# EasyEDA Pro project VGA_VCA821放大器.eprj

# Schematic Schematic2

## Sheets
1 P1: Board Name: Board1; Create Date: 2025-02-21; Page Name: P1; Project Name: VGA_VCA821放大器; Schematic Name: Schematic2; Update Date: 2025-05-27; Company: 嘉立创EDA; Page Size: A4; Version: V1.0
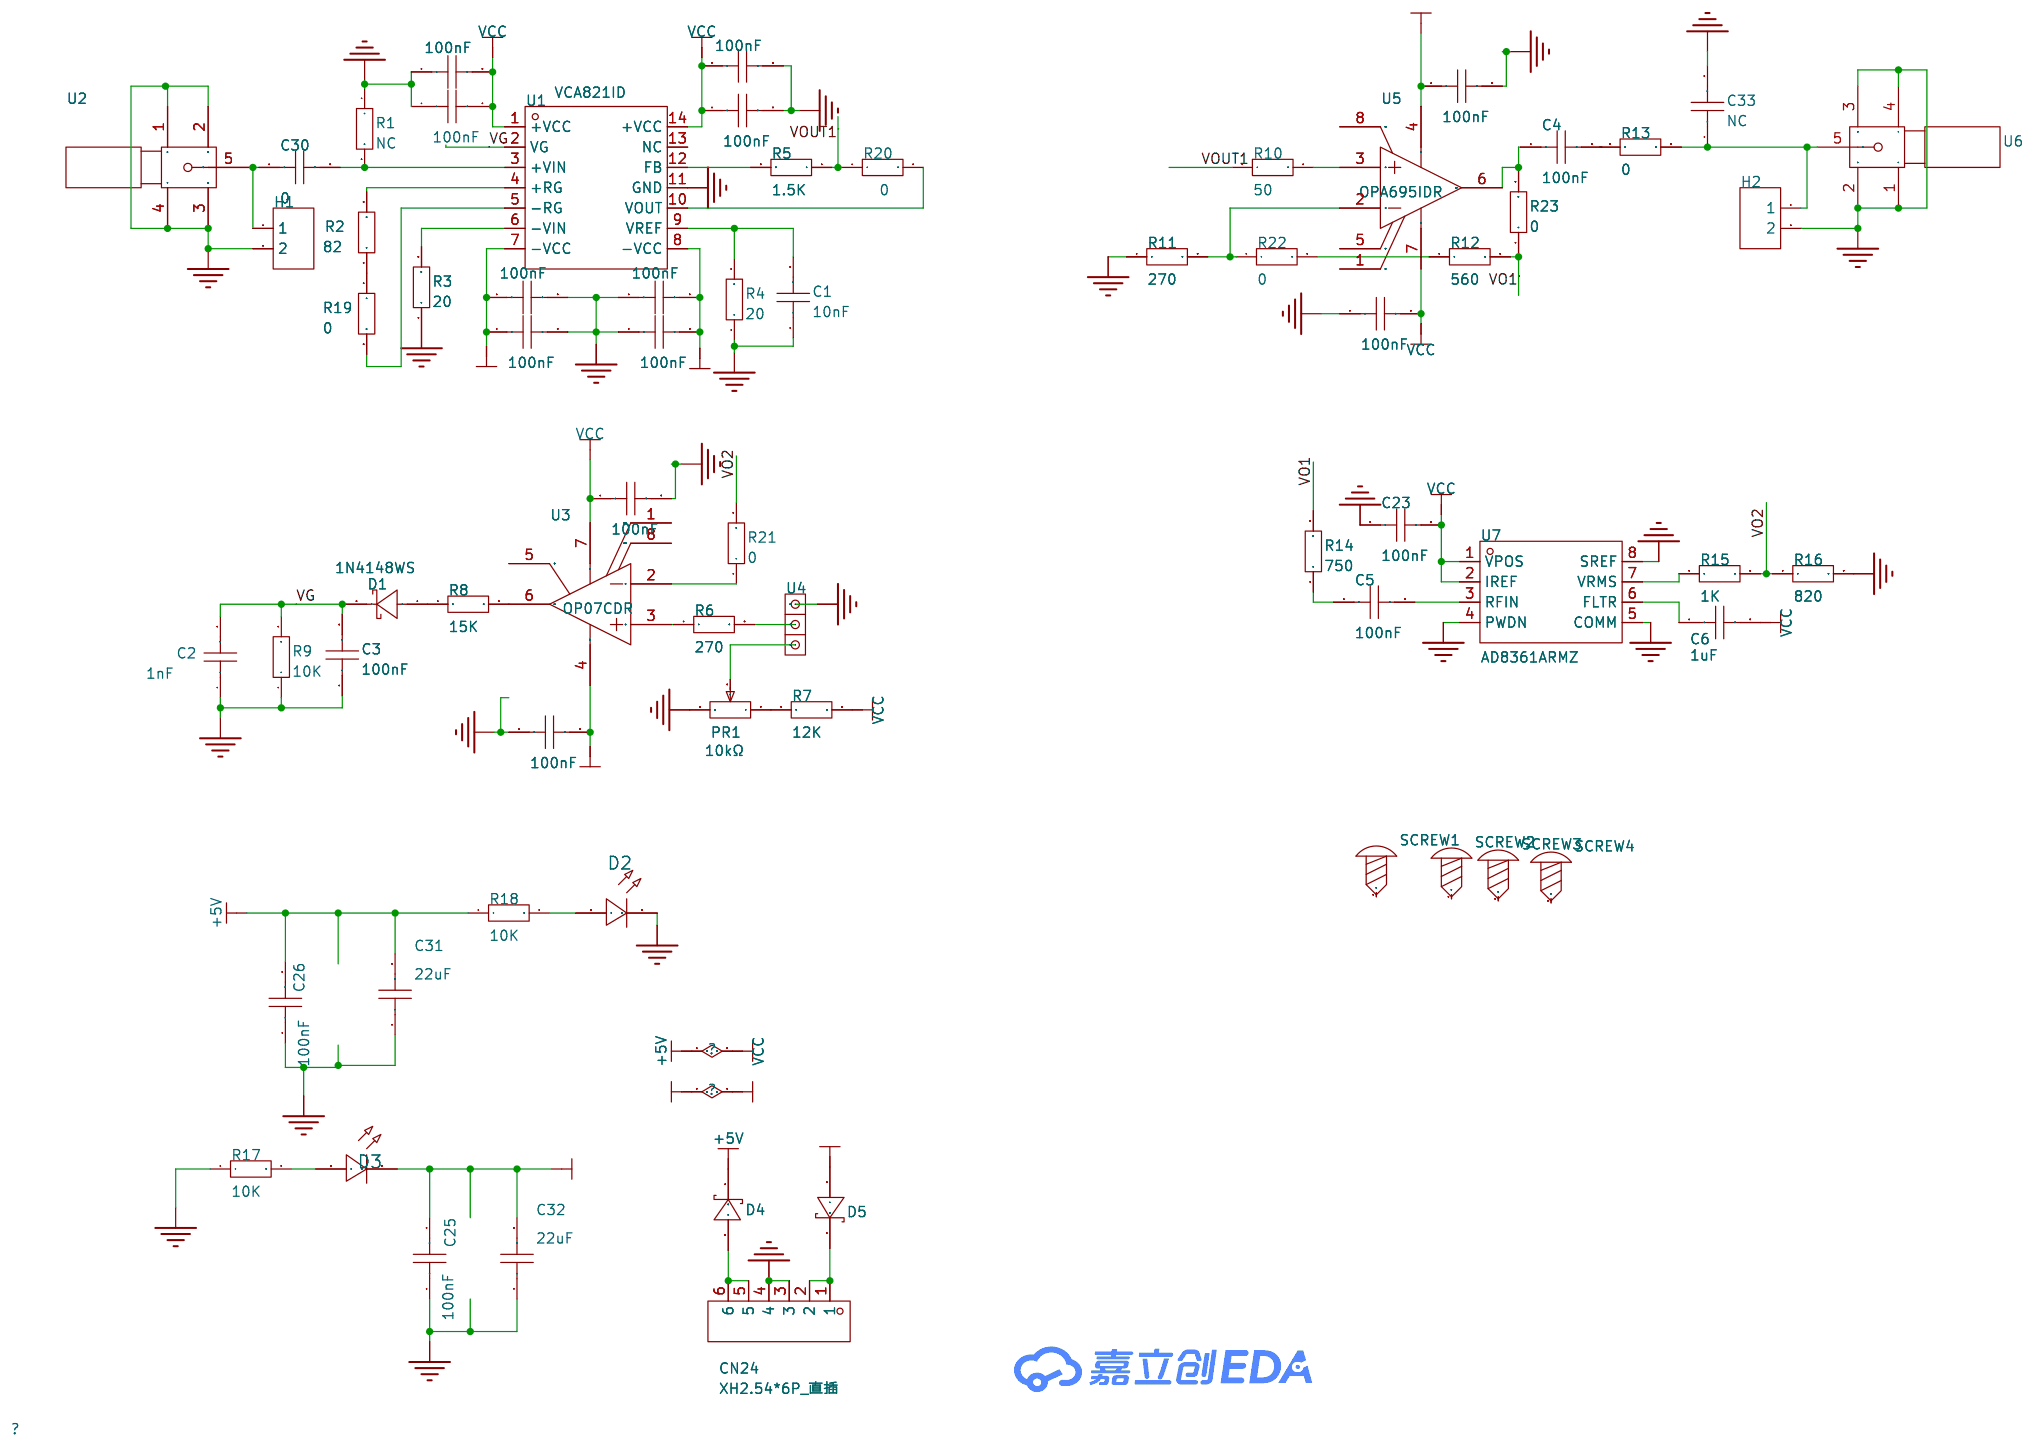
[diagram p0: P1]
2 P2: Create Date: 2025-05-26; Page Name: P2; Update Date: 2025-07-02
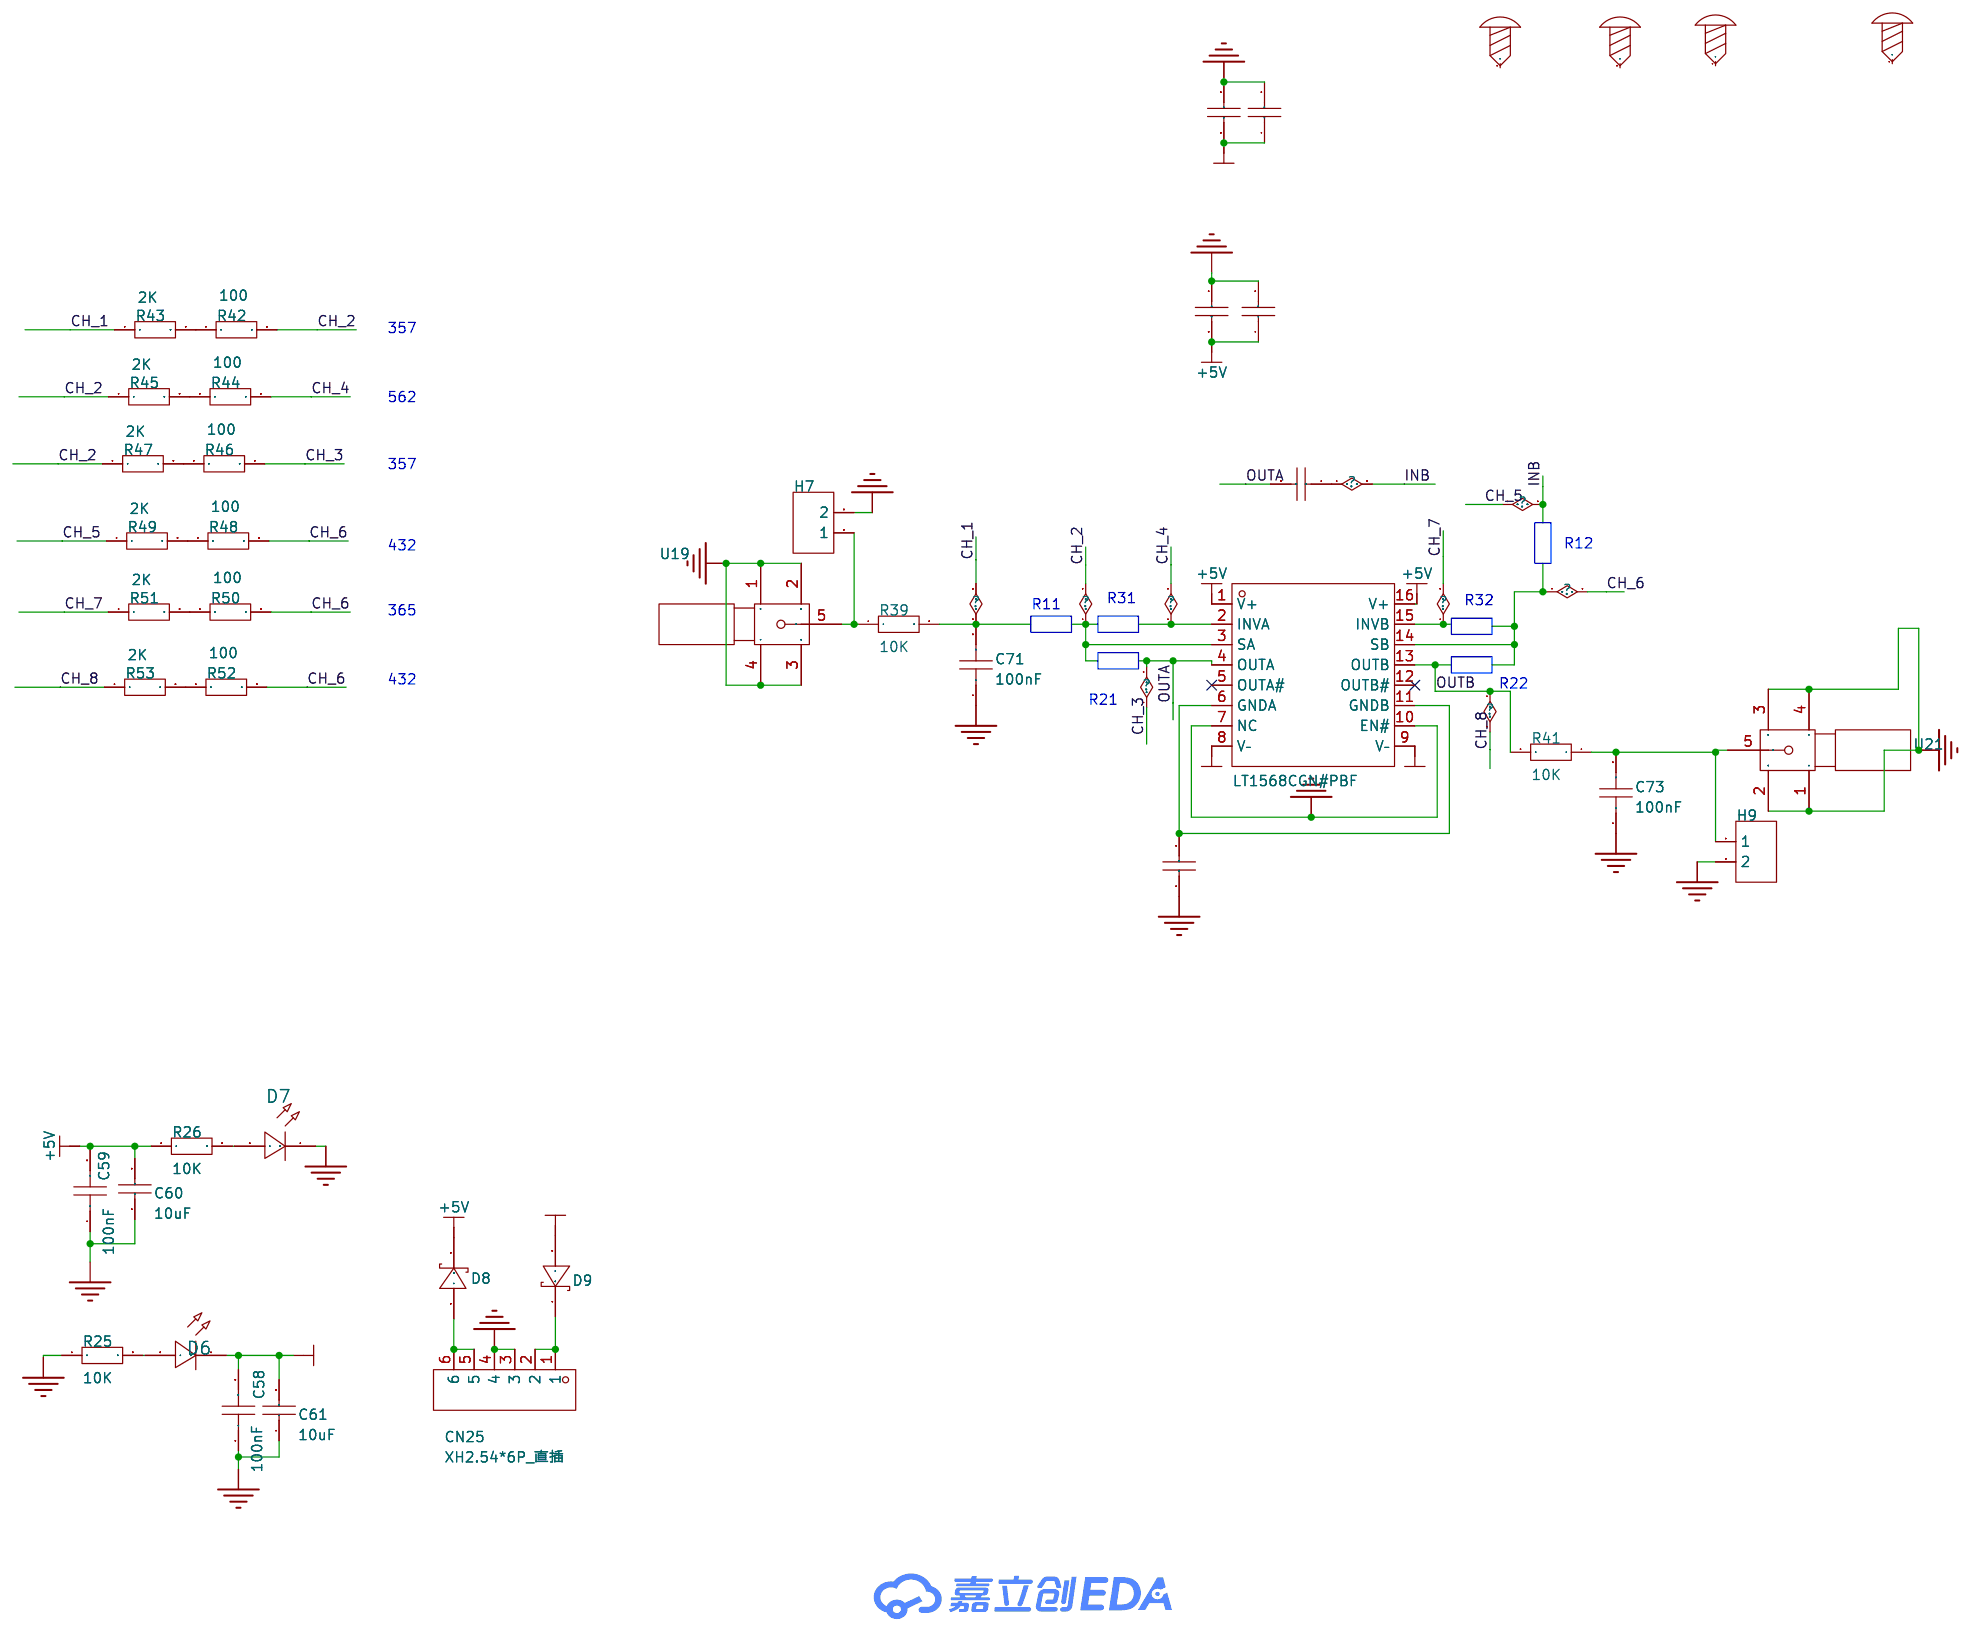
[diagram p1: P2]
3 P3: Create Date: 2025-05-26; Page Name: P3
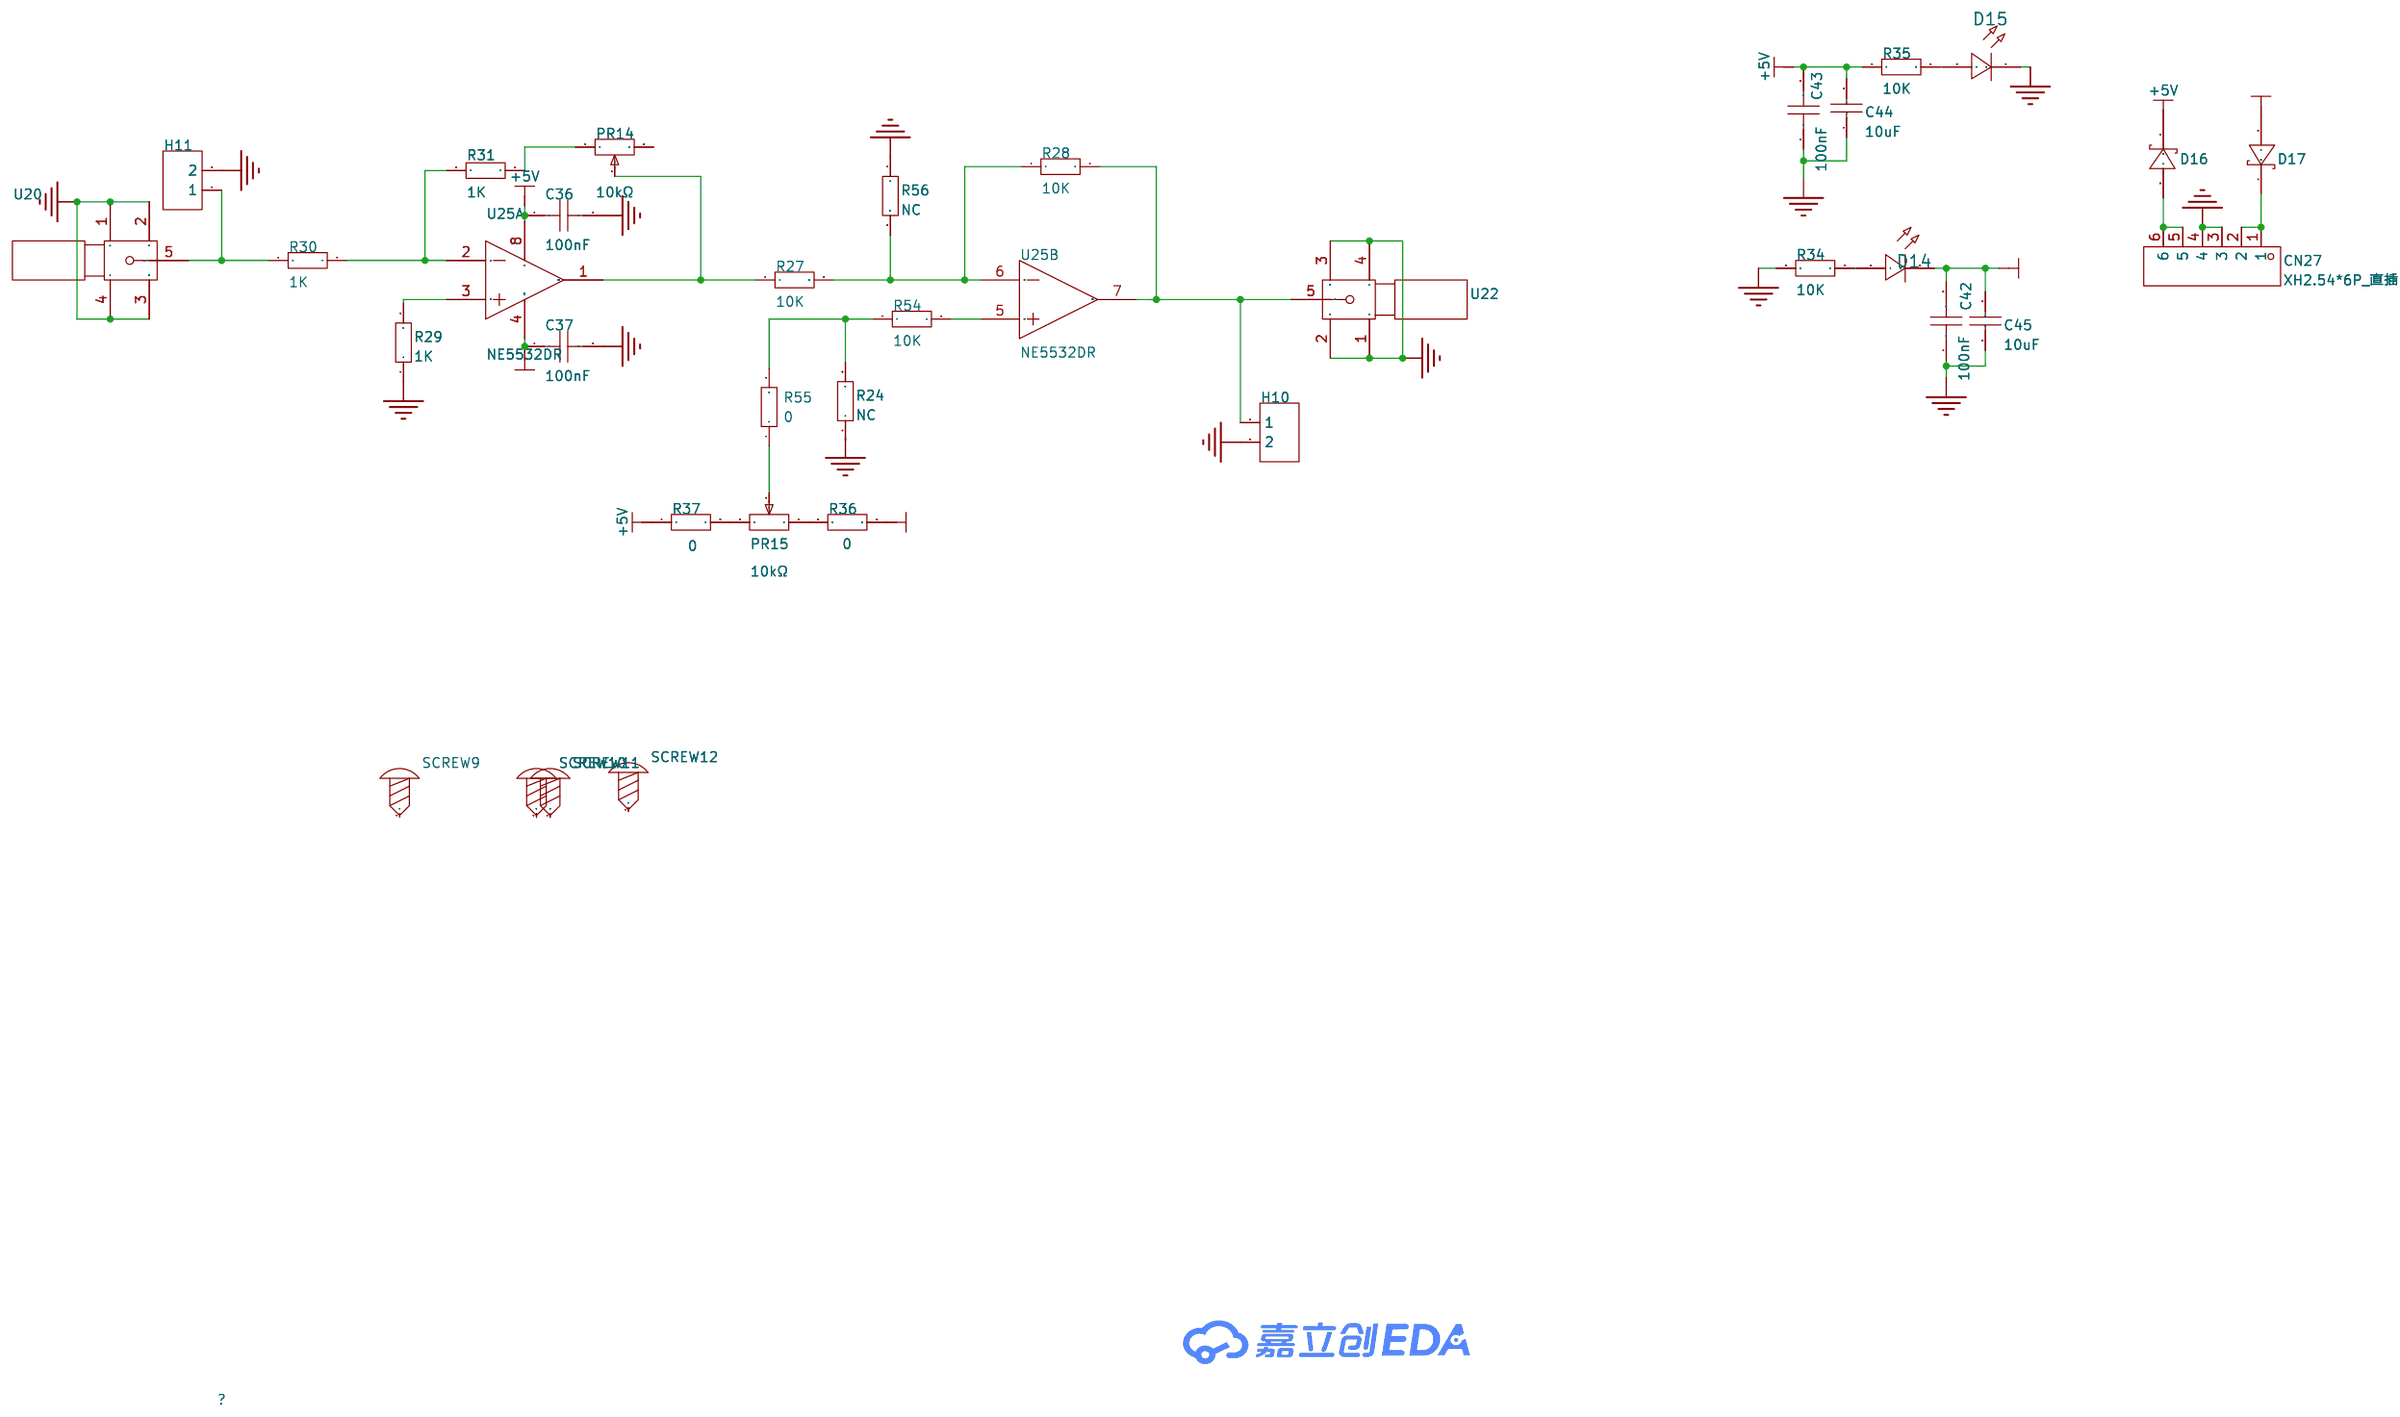
[diagram p2: P3]
4 P4: Create Date: 2025-05-26; Page Name: P4; Update Date: 2025-07-03
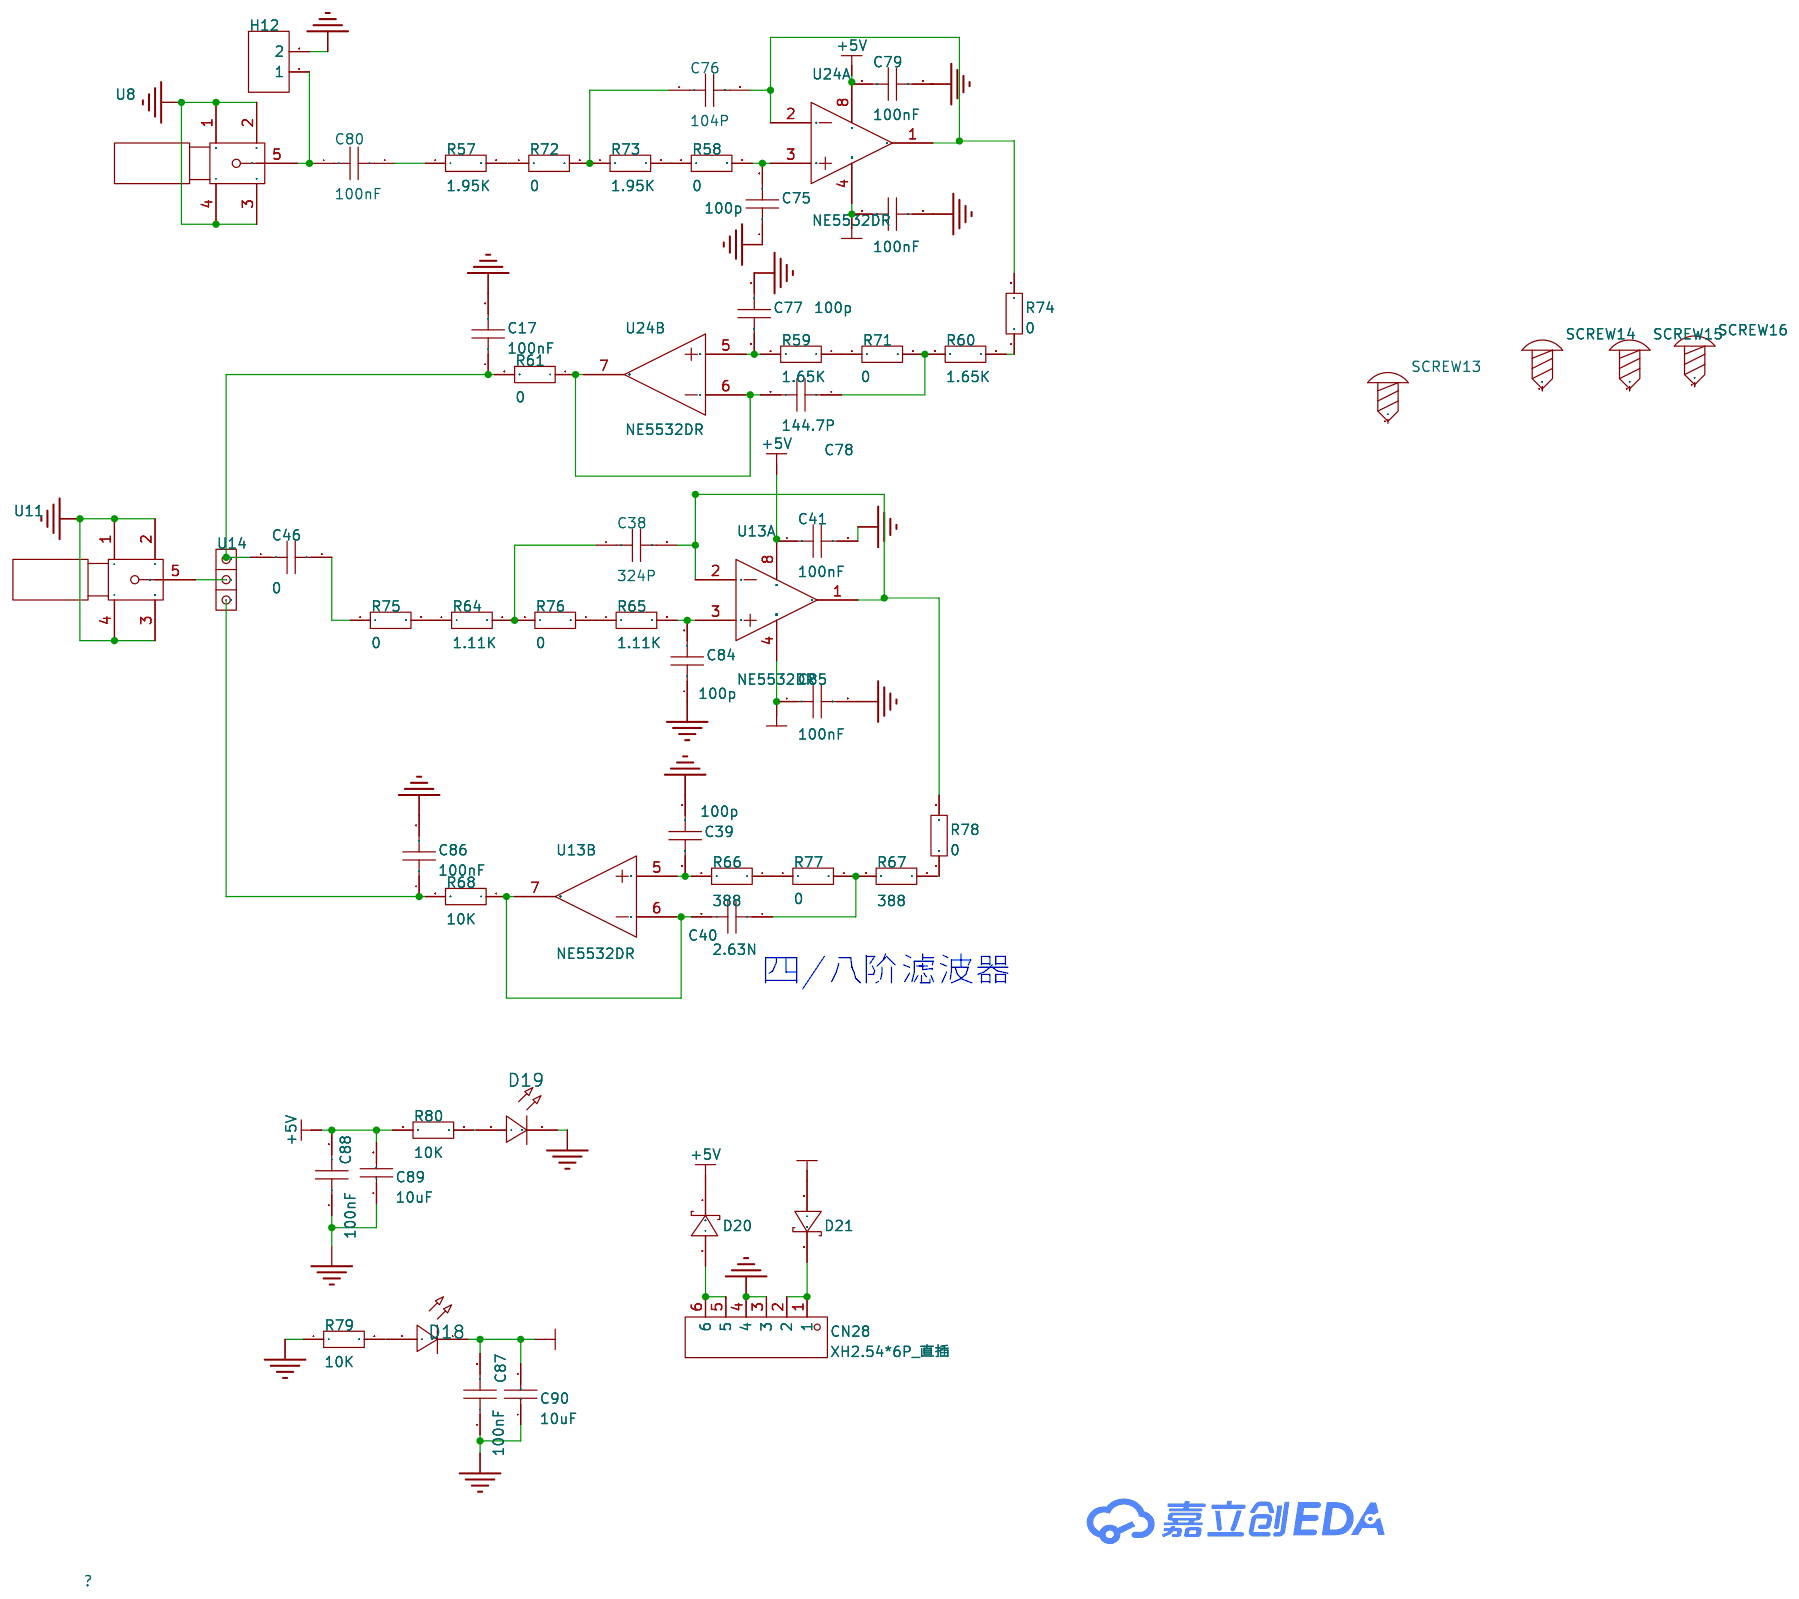
[diagram p3: P4]

## Parts
sheet P1
C1  10nF  [R0805]
C2  1nF  [R0805]
C3  100nF  [R0805]
C4  100nF  [R0805]
C5  100nF  [R0805]
C6  1uF  [R0805]
C7  100nF  [R0805]
C8  100nF  [R0805]
C9  100nF  [R0805]
C10  100nF  [R0805]
C11  100nF  [R0805]
C12  100nF  [R0805]
C13  100nF  [R0805]
C14  100nF  [R0805]
C16  100nF  [R0805]
C18  100nF  [R0805]
C20  100nF  [R0805]
C22  100nF  [R0805]
C23  100nF  [R0805]
C25  100nF  [R0805]
C26  100nF  [R0805]
C30  0  [R0805]
C31  22uF  [C1210]
C32  22uF  [C1210]
C33  NC  [R0805]
CN24  XH2.54*6P_直插  [CONN-TH_XH2.54-6P]
D1  1N4148WS  [SOD-323_L1.7-W1.3-LS2.5-FD]
D2  -  [LED_0805]
D3  -  [LED_0805]
D4  SD103AWS  [SOD-323_L1.8-W1.3-LS2.5-RD]
D5  SD103AWS  [SOD-323_L1.8-W1.3-LS2.5-RD]
H1  -  [HDR-TH_2P-P2.54-V-F]
H2  -  [HDR-TH_2P-P2.54-V-F]
PR1  10kΩ  [R_3296]
R1  NC  [R0805]
R2  82  [R0805]
R3  20  [R0805]
R4  20  [R0805]
R5  1.5K  [R0805]
R6  270  [R0805]
R7  12K  [R0805]
R8  15K  [R0805]
R9  10K  [R0805]
R10  50  [R0805]
R11  270  [R0805]
R12  560  [R0805]
R13  0  [R0805]
R14  750  [R0805]
R15  1K  [R0805]
R16  820  [R0805]
R17  10K  [R0805]
R18  10K  [R0805]
R19  0  [R0805]
R20  0  [R0805]
R21  0  [R0805]
R22  0  [R0805]
R23  0  [R0805]
SCREW1  -  [M3螺丝]
SCREW2  -  [M3螺丝]
SCREW3  -  [M3螺丝]
SCREW4  -  [M3螺丝]
U1  VCA821ID  [SOIC-14_L8.7-W3.9-P1.27-LS6.0-BL]
U2  -  [SMA]
U3  OP07CDR  [SOIC-8_L4.9-W3.9-P1.27-LS6.0-BL]
U4  -  [1*3跳线]
U5  OPA695IDR  [SOIC-8_L5.0-W4.0-P1.27-LS6.1-BL]
U6  -  [SMA]
U7  AD8361ARMZ  [MSOP-8_L3.0-W3.0-P0.65-LS4.9-BL]
sheet P2
C58  100nF  [R0805]
C59  100nF  [R0805]
C60  10uF  [C1210]
C61  10uF  [C1210]
C62  104  [R0805]
C63  104  [R0805]
C66  104  [R0805]
C67  104  [R0805]
C70  104  [R0805]
C71  100nF  [R0805]
C73  100nF  [R0805]
C74  104  [R0805]
CN25  XH2.54*6P_直插  [CONN-TH_XH2.54-6P]
D6  -  [LED_0805]
D7  -  [LED_0805]
D8  SD103AWS  [SOD-323_L1.8-W1.3-LS2.5-RD]
D9  SD103AWS  [SOD-323_L1.8-W1.3-LS2.5-RD]
H7  -  [HDR-TH_2P-P2.54-V-F]
H9  -  [HDR-TH_2P-P2.54-V-F]
R25  10K  [R0805]
R26  10K  [R0805]
R39  10K  [R0805]
R41  10K  [R0805]
R42  100  [R0805]
R43  2K  [R0805]
R44  100  [R0805]
R45  2K  [R0805]
R46  100  [R0805]
R47  2K  [R0805]
R48  100  [R0805]
R49  2K  [R0805]
R50  100  [R0805]
R51  2K  [R0805]
R52  100  [R0805]
R53  2K  [R0805]
SCREW5  -  [M3螺丝]
SCREW6  -  [M3螺丝]
SCREW7  -  [M3螺丝]
SCREW8  -  [M3螺丝]
U18  LT1568CGN#PBF  [SSOP-16_L4.9-W3.9-P0.64-LS6.0-BL]
U19  -  [SMA]
U21  -  [SMA]
sheet P3
C36  100nF  [R0805]
C37  100nF  [R0805]
C42  100nF  [R0805]
C43  100nF  [R0805]
C44  10uF  [C1210]
C45  10uF  [C1210]
CN27  XH2.54*6P_直插  [CONN-TH_XH2.54-6P]
D14  -  [LED_0805]
D15  -  [LED_0805]
D16  SD103AWS  [SOD-323_L1.8-W1.3-LS2.5-RD]
D17  SD103AWS  [SOD-323_L1.8-W1.3-LS2.5-RD]
H10  -  [HDR-TH_2P-P2.54-V-F]
H11  -  [HDR-TH_2P-P2.54-V-F]
PR14  10kΩ  [R_3296]
PR15  10kΩ  [R_3296]
R24  NC  [R0805]
R27  10K  [R0805]
R28  10K  [R0805]
R29  1K  [R0805]
R30  1K  [R0805]
R31  1K  [R0805]
R34  10K  [R0805]
R35  10K  [R0805]
R36  0  [R0805]
R37  0  [R0805]
R54  10K  [R0805]
R55  0  [R0805]
R56  NC  [R0805]
SCREW9  -  [M3螺丝]
SCREW10  -  [M3螺丝]
SCREW11  -  [M3螺丝]
SCREW12  -  [M3螺丝]
U20  -  [SMA]
U22  -  [SMA]
U25  NE5532DR  [SOIC-8_L4.9-W3.9-P1.27-LS6.0-BL]  (sections 1,2)
sheet P4
C15  100nF  [R0805]
C17  100nF  [R0805]
C38  324P  [R0805]
C39  100p  [R0805]
C40  2.63N  [R0805]
C41  100nF  [R0805]
C46  0  [R0805]
C75  100p  [R0805]
C76  104P  [R0805]
C77  100p  [R0805]
C78  144.7P  [R0805]
C79  100nF  [R0805]
C80  100nF  [R0805]
C84  100p  [R0805]
C85  100nF  [R0805]
C86  100nF  [R0805]
C87  100nF  [R0805]
C88  100nF  [R0805]
C89  10uF  [C1210]
C90  10uF  [C1210]
CN28  XH2.54*6P_直插  [CONN-TH_XH2.54-6P]
D18  -  [LED_0805]
D19  -  [LED_0805]
D20  SD103AWS  [SOD-323_L1.8-W1.3-LS2.5-RD]
D21  SD103AWS  [SOD-323_L1.8-W1.3-LS2.5-RD]
H12  -  [HDR-TH_2P-P2.54-V-F]
R57  1.95K  [R0805]
R58  0  [R0805]
R59  1.65K  [R0805]
R60  1.65K  [R0805]
R61  0  [R0805]
R64  1.11K  [R0805]
R65  1.11K  [R0805]
R66  388  [R0805]
R67  388  [R0805]
R68  10K  [R0805]
R71  0  [R0805]
R72  0  [R0805]
R73  1.95K  [R0805]
R74  0  [R0805]
R75  0  [R0805]
R76  0  [R0805]
R77  0  [R0805]
R78  0  [R0805]
R79  10K  [R0805]
R80  10K  [R0805]
SCREW13  -  [M3螺丝]
SCREW14  -  [M3螺丝]
SCREW15  -  [M3螺丝]
SCREW16  -  [M3螺丝]
U8  -  [SMA]
U11  -  [SMA]
U13  NE5532DR  [SOIC-8_L4.9-W3.9-P1.27-LS6.0-BL]  (sections 1,2)
U14  -  [1*3跳线]
U24  NE5532DR  [SOIC-8_L4.9-W3.9-P1.27-LS6.0-BL]  (sections 1,2)

## Library data of the parts
C1-C18 C20 C22 C23 C25 C26 C30 C33 C36-C43 C46 C58 C59 C71 C73 C75-C80 C84-C88 = CAP_0805: Supplier Footprint: 0805
C31 C32 = CL32B226KAJNNNE: LCSC Part Name: 22uF ±10% 25V; Supplier Part: C309062; Manufacturer: SAMSUNG(三星); Supplier Footprint: 1210; JLCPCB Part Class: 扩展库; Datasheet: https://atta.szlcsc.com/upload/public/pdf/source/20160218/1457707763339.pdf; Supplier: LCSC; Tolerance: ±10%; Voltage Rated: 25V; Temperature Coefficient: X7R
CN24 CN25 CN27 CN28 = XH2.54*6P_直插: Supplier Part: C9900008614; Supplier Footprint: XH2.54_6P; JLCPCB Part Class: 扩展库; Supplier: LCSC
D1 = 1N4148WS_C7420319: Supplier Part: C7420319; Manufacturer: 宏迦橙; Supplier Footprint: SOD-323; JLCPCB Part Class: 扩展库; Datasheet: https://atta.szlcsc.com/upload/public/pdf/source/20240228/ACAE8A2B901F2FD417588BC59863BC16.pdf; Supplier: LCSC; Diode Configuration: 独立式; Forward Voltage (Vf@If): 1.25V@150mA; Reverse Voltage (Vr): 100V; Rectified Current: 150mA; Reverse Leakage Current (Ir): 1uA@75V; Reverse Recovery Time (trr): 4ns; Operating Temperature: -55℃~+150℃
D2 D3 D6 D7 D14 D15 D18 D19 = LED_0805-R: Supplier Footprint: 0805
D4 D5 D8 D9 D16 D17 D20 D21 = SD103AWS_C181207: 正向压降(Vf):600mV@200mA;直流反向耐压(Vr):40V;整流电流:350mA;; LCSC Part Name: 电压:40V 电流:350mA 丝印S4; Supplier Part: C181207; Manufacturer: Hottech(合科泰); Supplier Footprint: SOD-323; JLCPCB Part Class: 扩展库; Datasheet: https://atta.szlcsc.com/upload/public/pdf/source/20240513/4691873FBB9173EFBCF4C6FD4BBA1025.pdf; Supplier: LCSC; Forward Voltage (Vf@If): 600mV@200mA; Reverse Voltage (Vr): 40V; Rectified Current: 350mA
H1 H2 H7 H9-H12 = HDR-F_2.54_1x2P: Supplier Part: C49661; Supplier Footprint: 插件
PR1 PR14 PR15 = R_3296: Supplier Footprint: 直插
R1-R31 R34-R37 R39 R41-R61 R64-R68 R71-R80 = Res_0805: Supplier Footprint: 0805
SCREW1-SCREW16 = M3螺丝: Supplier Footprint: 插件
U1 = VCA821ID: Supplier Part: C2866982; Manufacturer: TI(德州仪器); Supplier Footprint: SOIC-14; JLCPCB Part Class: 扩展库; Datasheet: https://www.ti.com/cn/lit/gpn/vca821; Supplier: LCSC; Amplifier Type: VGA; Number of Channels: 单路; Bandwidth (-3dB): 710MHz; Slew Rate (SR): 2500V/us; Output Current: 90mA; Supply Current: 34mA; Operating Temperature: -40℃~+85℃
U2 U6 U8 U11 U19-U22 = SMA
U3 = OP07CDR: LCSC Part Name: 精密运算放大器; Supplier Part: C7433; Manufacturer: TI(德州仪器); Supplier Footprint: SOIC-8; JLCPCB Part Class: 基础库; Datasheet: http://www.ti.com/cn/lit/gpn/op07c; Supplier: LCSC; Number of Circuits: 单路; Gain Bandwidth Product(GBP): 600kHz; Current - Input Bias(Ib): 1.8nA; Slew Rate(SR): 0.3V/us; Operating Temperature: 0℃~+70℃
U4 U14 = 1*3跳线
U5 = OPA695IDR: Supplier Part: C1848175; Manufacturer: TI(德州仪器); Supplier Footprint: SOIC-8; JLCPCB Part Class: 扩展库; Datasheet: https://www.ti.com/cn/lit/gpn/opa695; Supplier: LCSC; Number of Circuits: 单路; Current - Input Bias(Ib): 20uA; Slew Rate(SR): 4300V/us; Output Current: 120mA; -3db Bandwidth: 1.7GHz; Operating Temperature: -40℃~+85℃
U7 = AD8361ARMZ: LCSC Part Name: RMS 功率检测器; Supplier Part: C578709; Manufacturer: ADI(亚德诺); Supplier Footprint: MSOP-8; JLCPCB Part Class: 扩展库; Datasheet: https://atta.szlcsc.com/upload/public/pdf/source/20200408/C130107_5C4C2FB002E66DB882E0E5EE2445969B.pdf; Supplier: LCSC; Applications: 手机；W-CDMA；CDMA; Frequency Range: 0MHz~2.5GHz; Input Range: -21dBm~5dBm; Supply Voltage: 2.7V~5.5V; Supply Current: 1.1mA; Accuracy: ±0.25dB; Operating Temperature: -40℃~+85℃
C44 C45 C60 C61 C89 C90 = CL32B106KAJNNNE: 容值:10uF;精度:±10%;额定电压:25V;材质(温度系数):X7R;; LCSC Part Name: 10uF ±10% 25V; Supplier Part: C39232; Manufacturer: SAMSUNG(三星); Supplier Footprint: 1210; JLCPCB Part Class: 扩展库; Datasheet: https://atta.szlcsc.com/upload/public/pdf/source/20160218/1457707763339.pdf; Supplier: LCSC; Tolerance: ±10%; Voltage Rated: 25V; Temperature Coefficient: X7R
C62 C63 C66 C67 C70 C74 = CL21C101JBANNNC: 容值:100pF;精度:±5%;额定电压:50V;材质(温度系数):C0G;; LCSC Part Name: 100pF ±5% 50V; Supplier Part: C1790; Manufacturer: SAMSUNG(三星); Supplier Footprint: 0805; JLCPCB Part Class: 基础库; Datasheet: https://atta.szlcsc.com/upload/public/pdf/source/20160218/1457707763339.pdf; Supplier: LCSC; Tolerance: ±5%; Voltage Rated: 50V; Temperature Coefficient: C0G
U18 = LT1568CGN#PBF: 极低噪声、高频有源 RC 滤波器单元式部件; Supplier Part: C579774; Manufacturer: ADI(亚德诺); Supplier Footprint: SSOP-16-150mil; JLCPCB Part Class: 扩展库; Datasheet: https://atta.szlcsc.com/upload/public/pdf/source/20221018/50C72796FB50C385BED47E5C4760EF7E.pdf; Supplier: LCSC
U13 U24 U25 = NE5532DR: 放大器数:双路;增益带宽积(GBP):10MHz;输入偏置电流(Ib):200nA;压摆率(SR):9V/us;带宽(-3db):-;; Supplier Part: C7426; Manufacturer: TI(德州仪器); Supplier Footprint: SOIC-8; JLCPCB Part Class: 基础库; Datasheet: http://www.ti.com/cn/lit/gpn/ne5532; Supplier: LCSC; Number of Circuits: 双路; Gain Bandwidth Product(GBP): 10MHz; Current - Input Bias(Ib): 200nA; Slew Rate(SR): 9V/us; Output Current: 38mA; Supply Current: 8mA; Operating Temperature: 0℃~+70℃

## Nets
+5V: C6.2 C7.1 C8.1 C9.2 C10.2 C16.1 C22.2 C23.2 C26.2 C31.2 C36.1 C41.1 C43.2 C44.2 C59.2 C60.2 C66.1 C67.2 C79.1 C88.2 C89.2 D4.1(C) D8.1(C) D16.1(C) D20.1(C) R7.2 R18.1 R26.1 R35.1 R37.1 R80.1 U1.1(+VCC) U1.14(+VCC) U3.7(VCC+) U5.7(+VS) U7.1(VPOS) U7.2(IREF) U13.8(VCC+) U18.1(V+) U18.16(V+) U24.8(VCC+) U25.8(VCC+)
-5V: C11.1 C12.1 C13.2 C14.2 C15.1 C18.2 C20.1 C25.2 C32.2 C37.1 C42.2 C45.2 C58.2 C61.2 C62.1 C63.2 C85.1 C87.2 C90.2 D3.1(C) D5.2(A) D6.1(C) D9.2(A) D14.1(C) D17.2(A) D18.1(C) D21.2(A) R36.2 U1.7(-VCC) U1.8(-VCC) U3.4(VCC-) U5.4(-VS) U13.4(VCC-/GND) U18.8(V–) U18.9(V–) U24.4(VCC-/GND) U25.4(VCC-/GND)
GND: C1.1 C2.1 C3.1 C7.2 C8.2 C9.1 C10.1 C11.2 C12.2 C13.1 C14.1 C15.2 C16.2 C17.2 C18.1 C20.2 C22.1 C23.1 C25.1 C26.1 C31.1 C32.1 C33.2 C36.2 C37.2 C39.1 C41.2 C42.1 C43.1 C44.1 C45.1 C58.1 C59.1 C60.1 C61.1 C62.2 C63.1 C66.2 C67.1 C70.1 C71.1 C73.1 C75.1 C77.1 C79.2 C84.1 C85.2 C86.2 C87.1 C88.1 C89.1 C90.1 CN24.3 CN24.4 CN25.3 CN25.4 CN27.3 CN27.4 CN28.3 CN28.4 D2.1(C) D7.1(C) D15.1(C) D19.1(C) H1.2 H2.2 H7.2 H9.2 H10.2 H11.2 H12.2 PR1.3 R1.1 R3.1 R4.1 R9.1 R11.1 R16.2 R17.1 R24.1 R25.1 R29.1 R34.1 R56.1 R79.1 U1.11(GND) U2.1 U2.2 U2.3 U2.4 U4.3 U6.1 U6.2 U6.3 U6.4 U7.4(PWDN) U7.5(COMM) U7.8(SREF) U8.1 U8.2 U8.3 U8.4 U11.1 U11.2 U11.3 U11.4 U18.7(NC) U18.10(EN#) U19.1 U19.2 U19.3 U19.4 U20.1 U20.2 U20.3 U20.4 U21.1 U21.2 U21.3 U21.4 U22.1 U22.2 U22.3 U22.4
CH_1: C71.2 R39.2 R43.1
CH_2: R42.2 R45.1 R47.1 U18.3(SA)
CH_3: C74.2 R46.2 U18.4(OUTA)
CH_4: R44.2 U18.2(INVA)
CH_5: C74.1 R49.1
CH_6: R48.2 R50.2 R52.2 U18.14(SB)
CH_7: R51.1 U18.15(INVB)
CH_8: R41.2 R53.1 U18.13(OUTB)
VG: C2.2 C3.2 D1.2(K) R9.2 U1.2(VG)
VO1: R12.2 R14.2 R23.1
VO2: R15.2 R16.1 R21.2
VOUT1: R5.1 R10.1 R20.1
$1N491: C30.2 R1.2 U1.3(+VIN)
$1N504: R3.2 U1.6(-VIN)
$1N512: R2.2 U1.4(+RG)
$1N517: R19.2 U1.5(-RG)
$1N643: R20.2 U1.10(VOUT)
$1N648: R5.2 U1.12(FB)
$1N687: C1.2 R4.2 U1.9(VREF)
$1N1069: R6.1 U3.3(IN+)
$1N1078: PR1.2 U4.1
$1N1137: PR1.1 R7.1
$1N1275: R8.2 U3.6(OUT)
$1N1439: D1.1(A) R8.1
$1N1895: C4.2 R13.1
$1N1903: R10.2 U5.3(+IN)
$1N1952: R11.2 R22.1 U5.2(-IN)
$1N2033: C33.1 H2.1 R13.2 U6.5
$1N2249: C5.2 U7.3(RFIN)
$1N2305: C5.1 R14.1
$1N2544: R15.1 U7.7(VRMS)
$1N2549: C6.1 U7.6(FLTR)
$1N3910: D3.2(A) R17.2
$1N3915: D2.2(A) R18.2
$1N4189: C30.1 H1.1 U2.5
$1N4691: R2.1 R19.1
$1N4821: R21.1 U3.2(IN-)
$1N4890: R12.1 R22.2
$1N4959: C4.1 R23.2 U5.6(Output)
$1N9203: CN24.1 CN24.2 D5.1(C)
$1N9205: CN24.5 CN24.6 D4.2(A)
$1N10453: R6.2 U4.2
$2N1531: C73.2 H9.1 R41.1 U21.5
$2N1538: C70.2 U18.6(GNDA) U18.11(GNDB)
$2N1565: H7.1 R39.1 U19.5
$2N1568: CN25.1 CN25.2 D9.1(C)
$2N1570: D6.2(A) R25.2
$2N1573: CN25.5 CN25.6 D8.2(A)
$2N1579: D7.2(A) R26.2
$2N1653: R42.1 R43.2
$2N1703: R44.1 R45.2
$2N1753: R46.1 R47.2
$2N1803: R48.1 R49.2
$2N1853: R50.1 R51.2
$2N1903: R52.1 R53.2
$3N1231: D14.2(A) R34.2
$3N1232: CN27.5 CN27.6 D16.2(A)
$3N1233: CN27.1 CN27.2 D17.1(C)
$3N1240: D15.2(A) R35.2
$3N1461: H11.1 R30.2 U20.5
$3N1620: R30.1 R31.2 U25.2(IN1-)
$3N1622: PR14.2 R27.1 U25.1(OUT1)
$3N1624: R29.2 U25.3(IN1+)
$3N2038: R27.2 R28.1 R56.2 U25.6(IN2-)
$3N2039: R54.2 U25.5(IN2+)
$3N2040: H10.1 R28.2 U22.5 U25.7(OUT2)
$3N2047: R24.2 R54.1 R55.2
$3N2048: PR15.1 R36.1
$3N2049: PR15.2 R55.1
$3N2050: PR15.3 R37.2
$3N3220: PR14.1 R31.1
$4N1791: C80.1 H12.1 U8.5
$4N1794: C80.2 R57.1
$4N1799: C75.2 R58.2 U24.3(IN1+)
$4N1802: C78.1 R60.2 R71.2
$4N1806: C86.1 R68.2 U14.3
$4N1807: C17.1 C46.1 R61.2 U14.1
$4N1808: C78.2 R61.1 U24.6(IN2-) U24.7(OUT2)
$4N1809: C77.2 R59.2 U24.5(IN2+)
$4N1810: C84.2 R65.2 U13.3(IN1+)
$4N1817: C40.2 R68.1 U13.6(IN2-) U13.7(OUT2)
$4N1818: C39.2 R66.2 U13.5(IN2+)
$4N1821: U11.5 U14.2
$4N1832: C40.1 R67.2 R77.2
$4N1892: R59.1 R71.1
$4N1938: R57.2 R72.1
$4N2036: R58.1 R73.2
$4N2042: C76.1 R72.2 R73.1
$4N2148: R60.1 R74.1
$4N2160: C76.2 R74.2 U24.1(OUT1) U24.2(IN1-)
$4N2277: R64.1 R75.2
$4N2329: R65.1 R76.2
$4N2333: C38.1 R64.2 R76.1
$4N2347: C46.2 R75.1
$4N2430: R66.1 R77.1
$4N2466: R67.1 R78.1
$4N2477: C38.2 R78.2 U13.1(OUT1) U13.2(IN1-)
$4N3036: CN28.5 CN28.6 D20.2(A)
$4N3037: CN28.1 CN28.2 D21.1(C)
$4N3040: D19.2(A) R80.2
$4N3044: D18.2(A) R79.2

Not connected (* = marked no-connect by the designer): PR14 3; SCREW1 1; SCREW2 1; SCREW3 1; SCREW4 1; SCREW5 1; SCREW6 1; SCREW7 1; SCREW8 1; SCREW9 1; SCREW10 1; SCREW11 1; SCREW12 1; SCREW13 1; SCREW14 1; SCREW15 1; SCREW16 1; U1 13(NC); U3 1(OFFSET N1) 5(NC) 8(OFFSET N2); U5 1(NC) 5(NC) 8(DIS#); U18 5(OUTA#)* 12(OUTB#)*

## Notes on the sheets
sheet 2
- 357
- 562
- 357
- R12
- 432
- 365
- R11
- R31
- R32
- 432
- R22
- R21
sheet 4
- 四/八阶滤波器

# Board PCB2
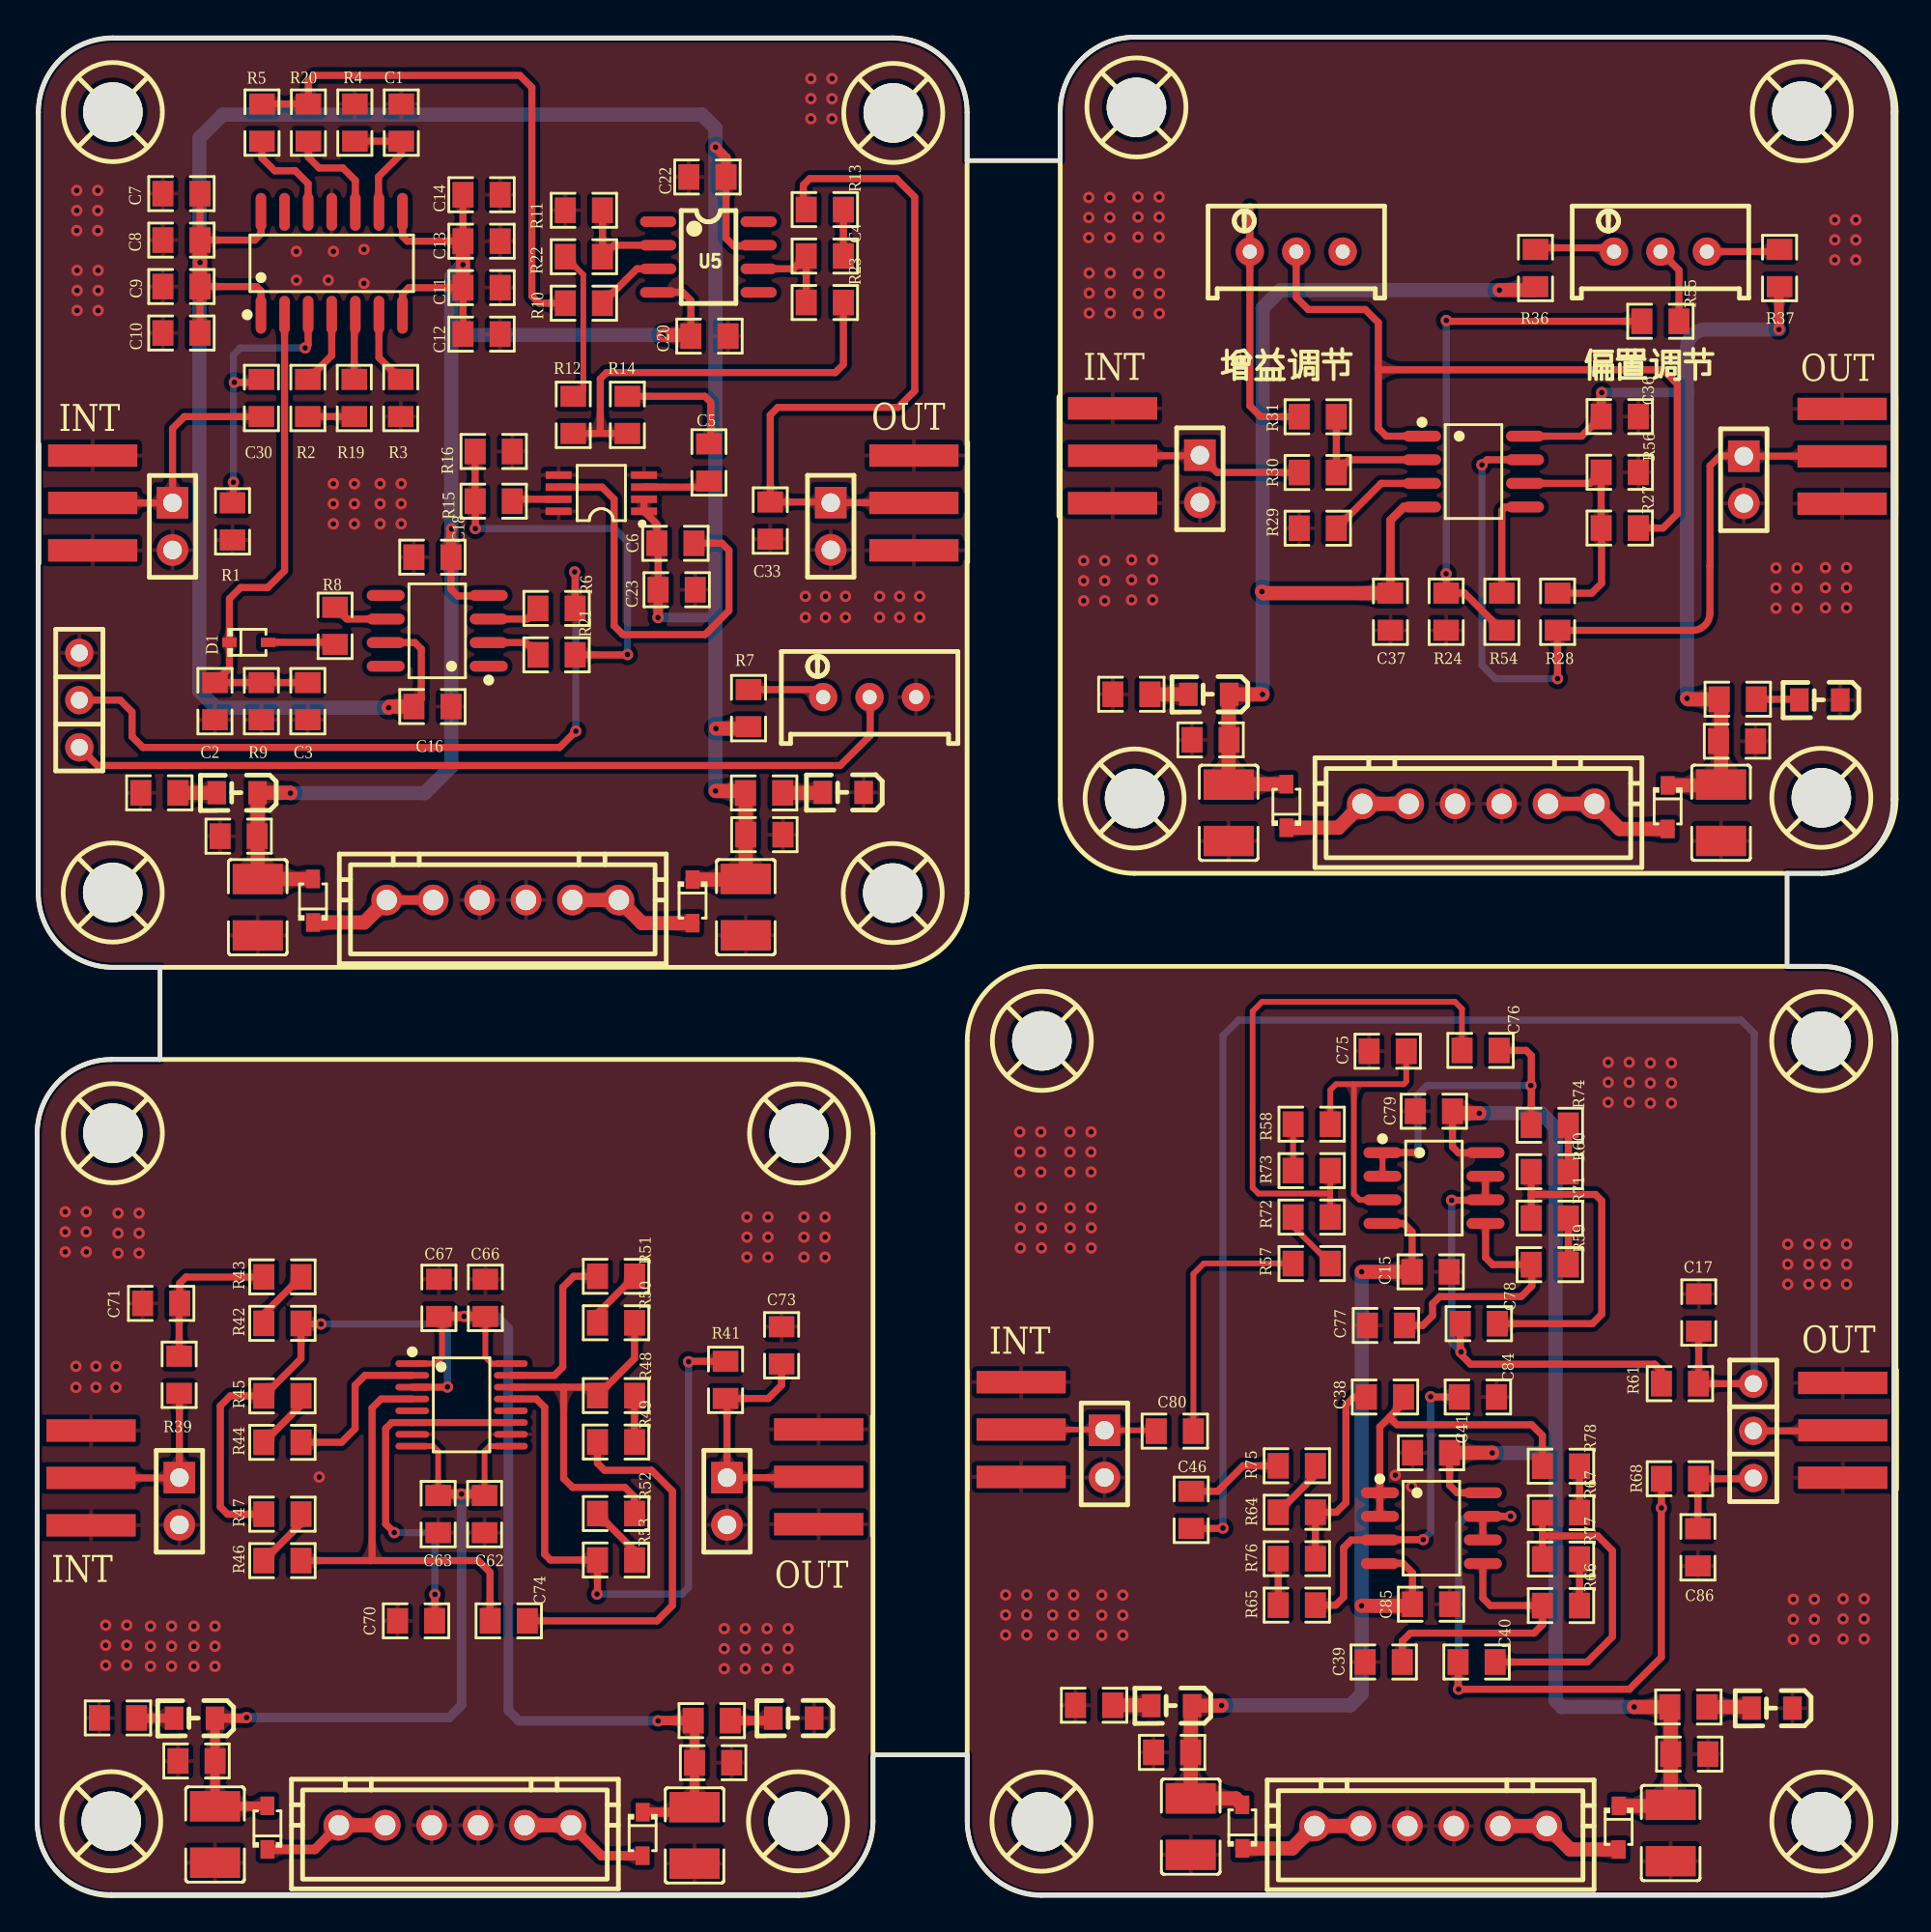
[diagram p4: board, top side]
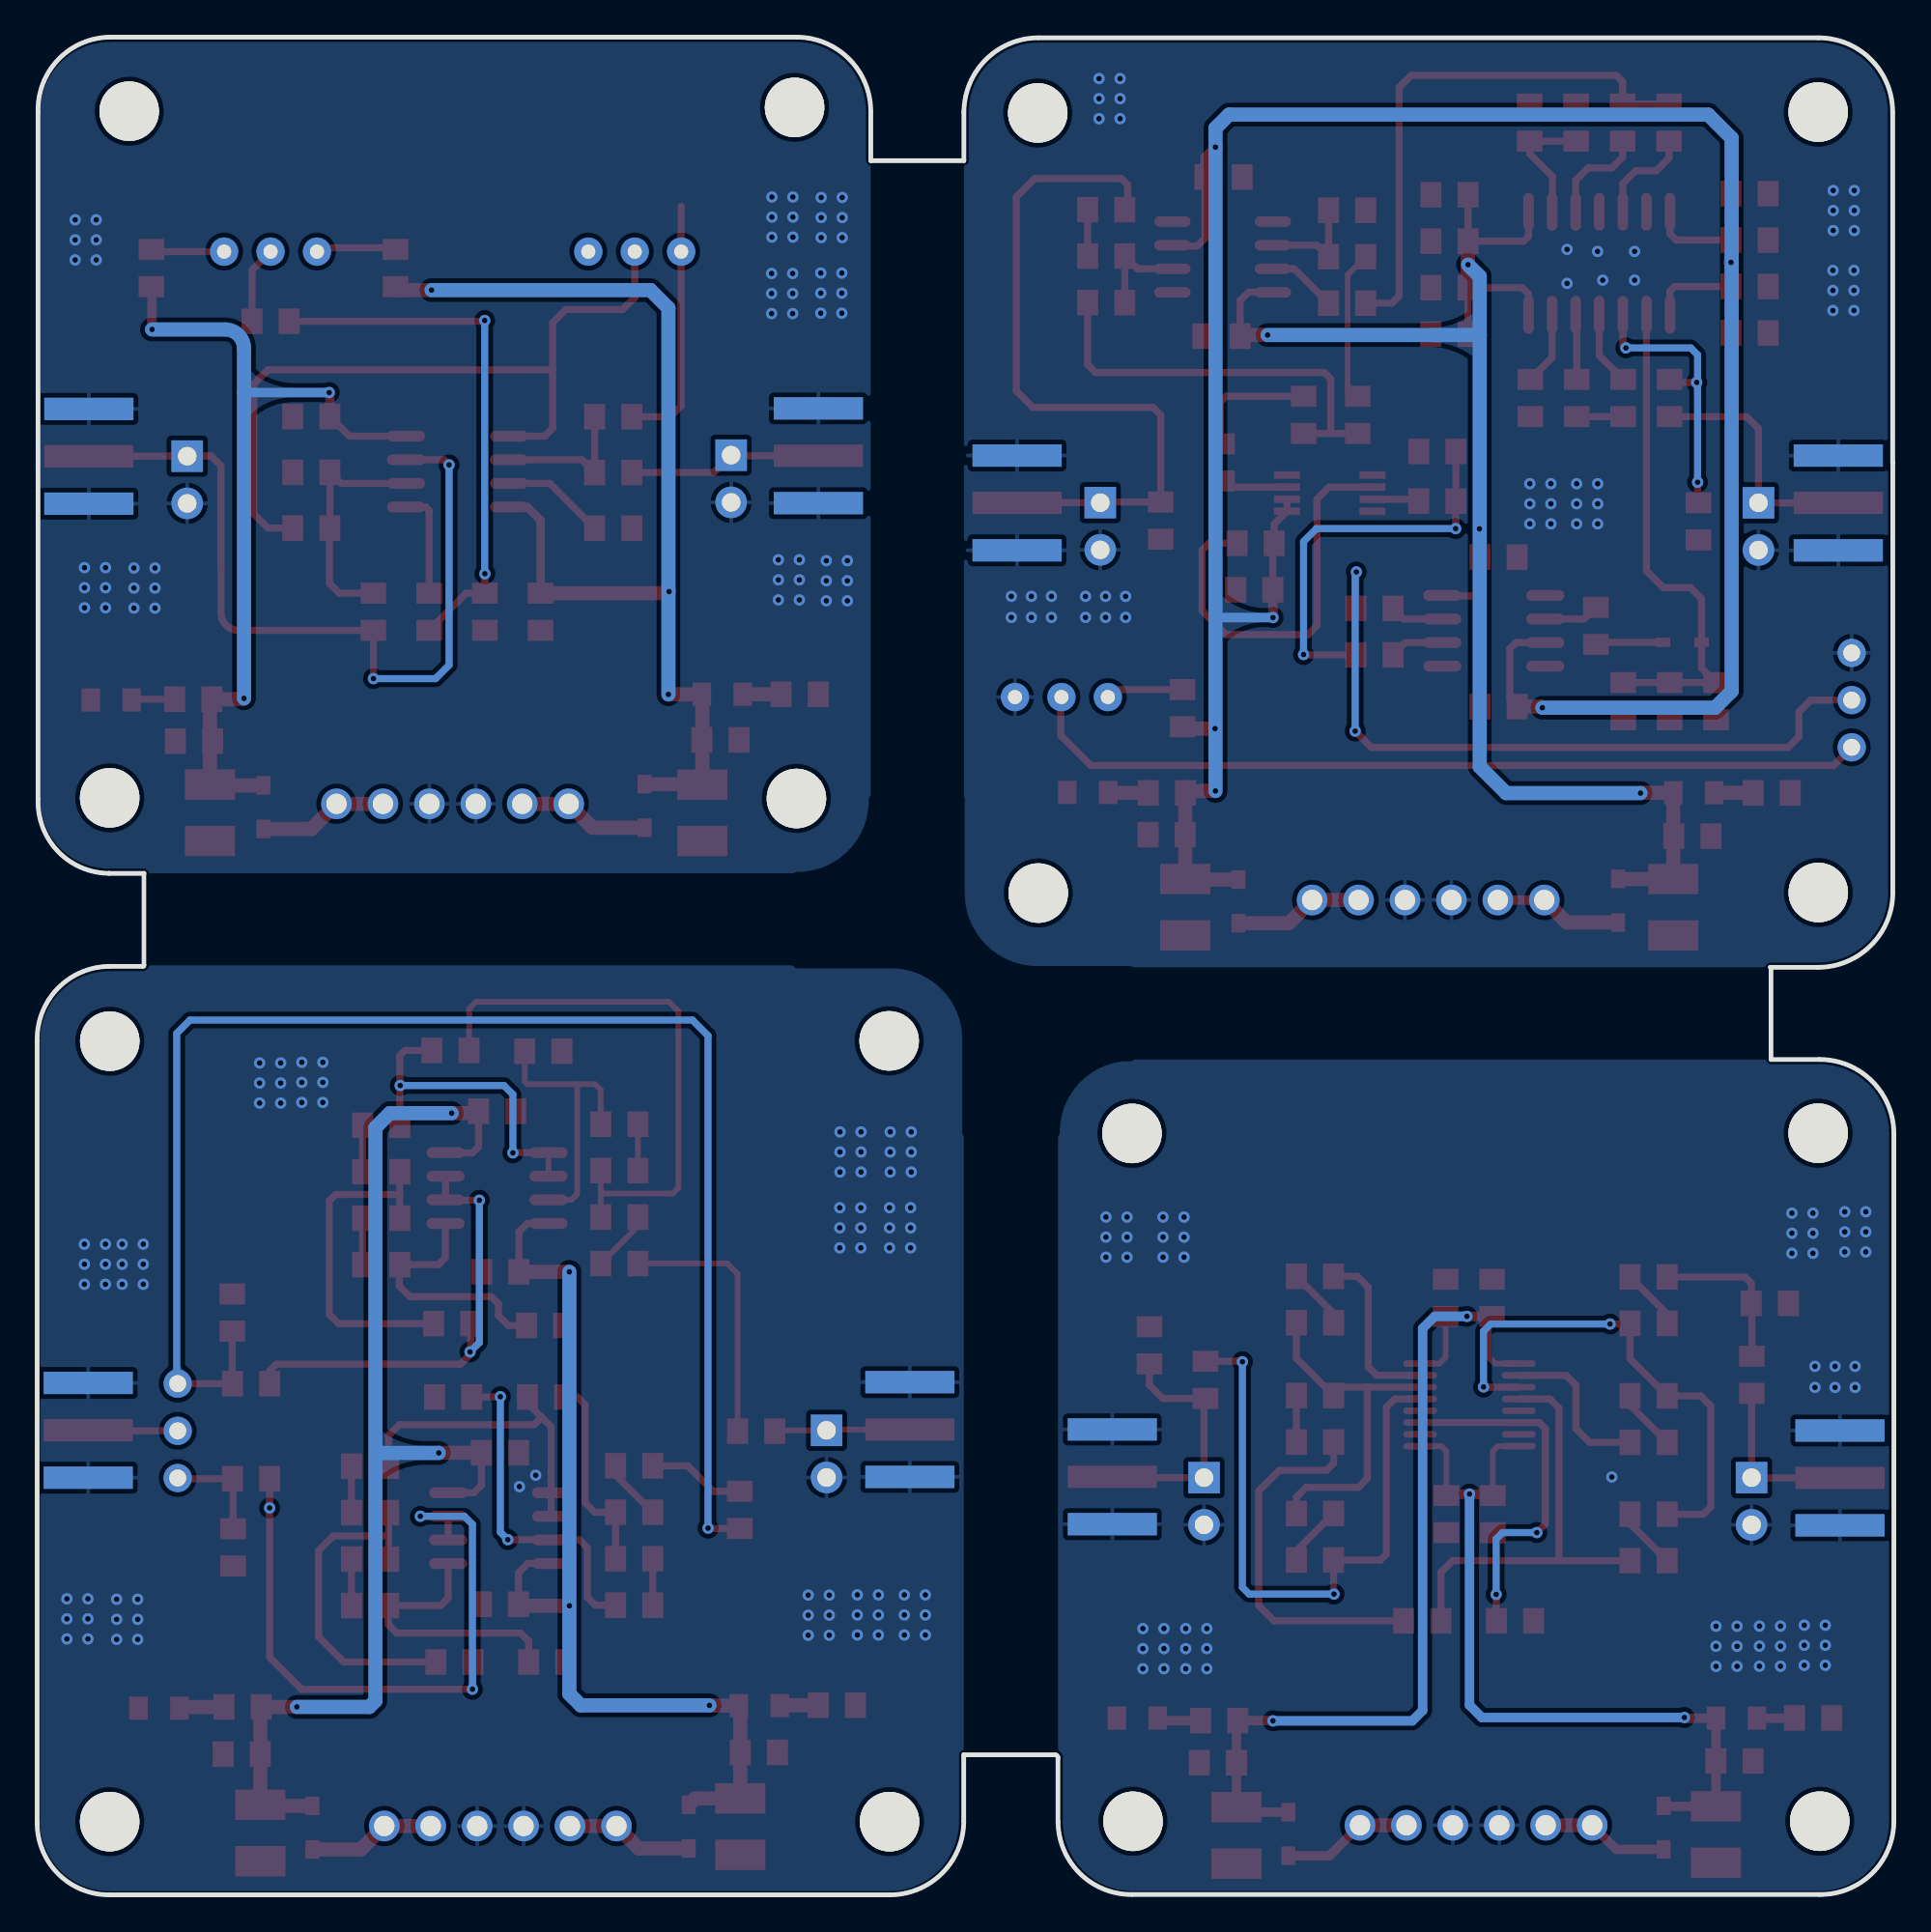
[diagram p5: board, bottom side, seen from below]

Outline 99.96 x 99.97 mm; copper layers: Top Layer, Bottom Layer. Coordinates in mm from the lower left corner of the outline.
Outline path: 0,40.95 arc(1.17,43.78) 4,44.95 6.61,44.95 6.61,49.88 arc(6.62,49.9) 6.65,49.91 4.09,49.91 arc(1.24,51.09) 0.06,53.95 0.06,77.09 arc(0.06,77.09) 0.07,77.1 0.07,95.95 arc(1.23,98.77) 4.06,99.94 46.04,99.94 arc(48.89,98.76) 50.07,95.91 50.07,93.33 55.07,93.33 arc(55.08,93.33) 55.08,93.34 55.08,95.97 arc(56.25,98.8) 59.08,99.97 96.02,99.97 arc(98.82,98.77) 99.91,95.94 99.91,58.95 arc(98.83,56.15) 96.08,54.97 94.21,54.97 94.21,50.02 arc(94.23,49.98) 94.27,49.97 96.06,49.97 arc(98.85,48.78) 99.96,45.97 99.96,3.94 arc(98.84,1.14) 96.06,0 54.1,0 arc(51.26,1.14) 50.07,3.97 50.07,7.54 45.15,7.54 arc(45.04,7.49) 45,7.39 45,3.95 arc(43.82,1.15) 41,0.02 4,0.02 arc(1.18,1.15) 0,3.95 0,40.95
Stack: Top Layer 0.035mm / Dielectric1 1.51mm FR4 er 4.5 / Bottom Layer 0.035mm

## Design rules (mm)
template: 自定义配置
spacing copperThickness1oz (default): track to track 0.102, other pairs 0.152 to 0.3
spacing copperThickness2oz: track to track 0.203, other pairs 0.152 to 0.3
track width copperThickness1oz (default): min 0.127, default 0.381, max 2.54
track width copperThickness2oz: min 0.203, default 0.254, max 2.54
differential pair differentialPair (default): width min 0.127, default 0.254, max 2.54; gap min 0.152, default 0.152
via viaSize (default): diameter min 0.5, default 0.61, max 10; hole min 0.3, default 0.305, max 6.3

## Placement (name value [footprint] x y rotation side)
C1  10nF  [R0805]  19.6 95.26 270 top
C2  1nF  [R0805]  9.57 64.35 90 top
C3  100nF  [R0805]  14.57 64.35 90 top
C4  100nF  [R0805]  42.52 88.19 0 top
C5  100nF  [R0805]  36.17 76.97 270 top
C6  1uF  [R0805]  34.25 72.73 180 top
C7  100nF  [R0805]  7.66 91.55 180 top
C8  100nF  [R0805]  7.66 89.05 180 top
C9  100nF  [R0805]  7.88 86.55 0 top
C10  100nF  [R0805]  7.88 84.05 0 top
C11  100nF  [R0805]  24.04 86.49 0 top
C12  100nF  [R0805]  24.04 83.99 0 top
C13  100nF  [R0805]  23.81 88.99 180 top
C14  100nF  [R0805]  23.81 91.49 180 top
C15  100nF  [R0805]  75.13 33.53 0 top
C16  100nF  [R0805]  21.39 63.95 0 top
C17  100nF  [R0805]  89.46 31.45 90 top
C18  100nF  [R0805]  21.39 71.99 0 top
C20  100nF  [R0805]  36.31 83.88 0 top
C22  100nF  [R0805]  36.2 92.45 0 top
C23  100nF  [R0805]  34.32 70.23 180 top
C25  100nF  [R0805]  10.96 56.97 0 top
C26  100nF  [R0805]  39.04 57.05 180 top
C30  0  [R0805]  12.07 80.66 90 top
C31  22uF  [C1210]  38.15 53.15 90 top
C32  22uF  [C1210]  11.88 53.15 90 top
C33  NC  [R0805]  39.47 73.85 270 top
C36  100nF  [R0805]  85.31 79.55 0 top
C37  100nF  [R0805]  72.86 68.94 270 top
C38  324P  [R0805]  72.68 26.79 0 top
C39  100p  [R0805]  72.61 12.53 0 top
C40  2.63N  [R0805]  77.38 12.53 180 top
C41  100nF  [R0805]  74.93 23.79 180 top
C42  100nF  [R0805]  63.28 62.15 0 top
C43  100nF  [R0805]  91.41 62.08 180 top
C44  10uF  [C1210]  90.66 58.23 90 top
C45  10uF  [C1210]  64.15 58.23 90 top
C46  0  [R0805]  62.13 20.83 90 top
C58  100nF  [R0805]  8.69 7.2 0 top
C59  100nF  [R0805]  36.28 7.11 180 top
C60  10uF  [C1210]  35.39 3.2 90 top
C61  10uF  [C1210]  9.58 3.25 90 top
C62  104  [R0805]  24.09 20.38 270 top
C63  104  [R0805]  21.59 20.6 90 top
C66  104  [R0805]  24.13 32.24 90 top
C67  104  [R0805]  21.63 32.01 270 top
C70  104  [R0805]  20.51 14.75 0 top
C71  100nF  [R0805]  6.79 31.83 0 top
C73  100nF  [R0805]  40.08 29.46 270 top
C74  104  [R0805]  25.28 14.75 180 top
C75  100p  [R0805]  72.82 45.4 0 top
C76  104P  [R0805]  77.82 45.44 0 top
C77  100p  [R0805]  72.73 30.64 0 top
C78  144.7P  [R0805]  77.5 30.74 180 top
C79  100nF  [R0805]  75.08 42.17 180 top
C80  100nF  [R0805]  61.36 24.95 0 top
C84  100p  [R0805]  77.45 26.79 180 top
C85  100nF  [R0805]  75.16 15.64 0 top
C86  100nF  [R0805]  89.41 18.59 270 top
C87  100nF  [R0805]  61.21 7.67 0 top
C88  100nF  [R0805]  88.83 7.57 180 top
C89  10uF  [C1210]  87.94 3.33 90 top
C90  10uF  [C1210]  62.1 3.67 90 top
CN24  XH2.54*6P_直插  [CONN-TH_XH2.54-6P]  25.07 53.54 0 top
CN25  XH2.54*6P_直插  [CONN-TH_XH2.54-6P]  22.49 3.75 0 top
CN27  XH2.54*6P_直插  [CONN-TH_XH2.54-6P]  77.59 58.71 0 top
CN28  XH2.54*6P_直插  [CONN-TH_XH2.54-6P]  75.02 3.7 0 top
D1  1N4148WS  [SOD-323_L1.7-W1.3-LS2.5-FD]  11.39 67.4 180 top
D2  -  [LED_0805]  43.35 59.33 180 top
D3  -  [LED_0805]  10.72 59.31 180 top
D4  SD103AWS  [SOD-323_L1.8-W1.3-LS2.5-RD]  35.28 53.46 270 top
D5  SD103AWS  [SOD-323_L1.8-W1.3-LS2.5-RD]  14.85 53.5 90 top
D6  -  [LED_0805]  8.42 9.51 180 top
D7  -  [LED_0805]  40.68 9.51 180 top
D8  SD103AWS  [SOD-323_L1.8-W1.3-LS2.5-RD]  32.6 3.28 270 top
D9  SD103AWS  [SOD-323_L1.8-W1.3-LS2.5-RD]  12.4 3.62 90 top
D14  -  [LED_0805]  63.02 64.61 180 top
D15  -  [LED_0805]  95.92 64.31 180 top
D16  SD103AWS  [SOD-323_L1.8-W1.3-LS2.5-RD]  87.78 58.53 270 top
D17  SD103AWS  [SOD-323_L1.8-W1.3-LS2.5-RD]  67.26 58.6 90 top
D18  -  [LED_0805]  61.03 10.19 180 top
D19  -  [LED_0805]  93.35 10.05 180 top
D20  SD103AWS  [SOD-323_L1.8-W1.3-LS2.5-RD]  85.14 3.61 270 top
D21  SD103AWS  [SOD-323_L1.8-W1.3-LS2.5-RD]  64.88 3.67 90 top
H1  -  [HDR-TH_2P-P2.54-V-F]  7.29 73.64 270 top
H2  -  [HDR-TH_2P-P2.54-V-F]  42.72 73.65 270 top
H7  -  [HDR-TH_2P-P2.54-V-F]  7.66 21.18 270 top
H9  -  [HDR-TH_2P-P2.54-V-F]  37.14 21.18 270 top
H10  -  [HDR-TH_2P-P2.54-V-F]  91.88 76.15 270 top
H11  -  [HDR-TH_2P-P2.54-V-F]  62.6 76.21 270 top
H12  -  [HDR-TH_2P-P2.54-V-F]  57.46 23.73 270 top
PR1  10kΩ  [R_3296]  44.81 64.58 0 top
PR14  10kΩ  [R_3296]  67.79 88.56 0 top
PR15  10kΩ  [R_3296]  87.39 88.56 0 top
R1  NC  [R0805#2]  10.52 73.91 90 top
R2  82  [R0805#2]  14.57 80.55 90 top
R3  20  [R0805#2]  19.57 80.55 90 top
R4  20  [R0805#2]  17.1 95.37 270 top
R5  1.5K  [R0805#2]  12.1 95.37 270 top
R6  270  [R0805#2]  27.96 69.23 0 top
R7  12K  [R0805#2]  38.3 63.86 270 top
R8  15K  [R0805#2]  16.04 68.29 90 top
R9  10K  [R0805#2]  12.07 64.24 90 top
R10  50  [R0805#2]  29.44 85.65 0 top
R11  270  [R0805#2]  29.44 90.65 0 top
R12  560  [R0805#2]  28.86 79.64 270 top
R13  0  [R0805#2]  42.41 90.69 180 top
R14  750  [R0805#2]  31.78 79.64 270 top
R15  1K  [R0805#2]  24.58 75 180 top
R16  820  [R0805#2]  24.58 77.67 0 top
R17  10K  [R0805#2]  6.58 59.3 0 top
R18  10K  [R0805#2]  39.14 59.3 0 top
R19  0  [R0805#2]  17.07 80.55 90 top
R20  0  [R0805#2]  14.6 95.37 270 top
R21  0  [R0805#2]  27.96 66.73 0 top
R22  0  [R0805#2]  29.44 88.15 180 top
R23  0  [R0805#2]  42.41 85.69 180 top
R24  NC  [R0805#2]  75.86 69.05 90 top
R25  10K  [R0805#2]  4.35 9.52 0 top
R26  10K  [R0805#2]  36.32 9.38 0 top
R27  10K  [R0805#2]  85.2 73.55 180 top
R28  10K  [R0805#2]  81.86 69.05 270 top
R29  1K  [R0805#2]  68.94 73.54 0 top
R30  1K  [R0805#2]  68.94 76.54 180 top
R31  1K  [R0805#2]  68.94 79.54 0 top
R34  10K  [R0805#2]  58.91 64.61 0 top
R35  10K  [R0805#2]  91.56 64.34 0 top
R36  0  [R0805#2]  80.66 87.55 270 top
R37  0  [R0805#2]  93.81 87.55 90 top
R39  10K  [R0805#2]  7.64 27.99 90 top
R41  10K  [R0805#2]  37.06 27.71 90 top
R42  100  [R0805#2]  13.2 30.75 0 top
R43  2K  [R0805#2]  13.2 33.25 0 top
R44  100  [R0805#2]  13.2 24.35 0 top
R45  2K  [R0805#2]  13.2 26.85 0 top
R46  100  [R0805#2]  13.2 17.99 0 top
R47  2K  [R0805#2]  13.2 20.49 0 top
R48  100  [R0805#2]  31.16 26.87 180 top
R49  2K  [R0805#2]  31.16 24.37 0 top
R50  100  [R0805#2]  31.16 30.79 0 top
R51  2K  [R0805#2]  31.16 33.29 0 top
R52  100  [R0805#2]  31.16 20.52 0 top
R53  2K  [R0805#2]  31.16 18.02 0 top
R54  10K  [R0805#2]  78.86 69.05 90 top
R55  0  [R0805#2]  87.39 84.68 180 top
R56  NC  [R0805#2]  85.2 76.55 180 top
R57  1.95K  [R0805#2]  68.62 33.97 0 top
R58  0  [R0805#2]  68.62 41.47 0 top
R59  1.65K  [R0805#2]  81.44 33.91 180 top
R60  1.65K  [R0805#2]  81.44 38.91 180 top
R61  0  [R0805#2]  88.44 27.51 0 top
R64  1.11K  [R0805#2]  67.82 20.59 0 top
R65  1.11K  [R0805#2]  67.82 15.59 0 top
R66  388  [R0805#2]  82.04 15.57 180 top
R67  388  [R0805#2]  82.04 20.57 180 top
R68  10K  [R0805#2]  88.44 22.39 0 top
R71  0  [R0805#2]  81.44 36.41 180 top
R72  0  [R0805#2]  68.62 36.47 0 top
R73  1.95K  [R0805#2]  68.62 38.97 180 top
R74  0  [R0805#2]  81.44 41.41 180 top
R75  0  [R0805#2]  67.82 23.09 0 top
R76  0  [R0805#2]  67.82 18.09 180 top
R77  0  [R0805#2]  82.04 18.07 180 top
R78  0  [R0805#2]  82.04 23.07 180 top
R79  10K  [R0805#2]  56.9 10.2 0 top
R80  10K  [R0805#2]  88.9 10.11 0 top
SCREW1  -  [M3螺丝]  4.07 53.94 0 top
SCREW2  -  [M3螺丝]  4.08 95.94 0 top
SCREW3  -  [M3螺丝]  46.09 95.89 0 top
SCREW4  -  [M3螺丝]  46.06 53.91 0 top
SCREW5  -  [M3螺丝]  4.08 40.99 0 top
SCREW6  -  [M3螺丝]  41.02 40.98 0 top
SCREW7  -  [M3螺丝]  40.96 3.96 0 top
SCREW8  -  [M3螺丝]  3.99 3.96 0 top
SCREW9  -  [M3螺丝]  59.18 96.19 0 top
SCREW10  -  [M3螺丝]  95 95.99 0 top
SCREW11  -  [M3螺丝]  59.08 59 0 top
SCREW12  -  [M3螺丝]  96.05 59.03 0 top
SCREW13  -  [M3螺丝]  54.09 45.96 0 top
SCREW14  -  [M3螺丝]  54.07 3.94 0 top
SCREW15  -  [M3螺丝]  96.05 45.94 0 top
SCREW16  -  [M3螺丝]  96.05 3.94 0 top
U1  VCA821ID  [SOIC-14_L8.7-W3.9-P1.27-LS6.0-BL]  15.86 87.8 0 top
U2  -  [SMA]  -0.82 69.04 0 top
U3  OP07CDR  [SOIC-8_L4.9-W3.9-P1.27-LS6.0-BL]  21.54 68.02 90 top
U4  -  [1*3跳线]  2.27 66.83 180 top
U5  OPA695IDR  [SOIC-8_L5.0-W4.0-P1.27-LS6.1-BL]  36.14 88.14 270 top
U6  -  [SMA]  51.01 80.77 180 top
U7  AD8361ARMZ  [MSOP-8_L3.0-W3.0-P0.65-LS4.9-BL]  30.37 75.43 90 top
U8  -  [SMA]  49.16 19.18 0 top
U11  -  [SMA]  101.02 30.86 180 top
U13  NE5532DR  [SOIC-8_L4.9-W3.9-P1.27-LS6.0-BL]  75.06 19.73 270 top
U14  -  [1*3跳线]  92.39 22.43 0 top
U18  LT1568CGN#PBF  [SSOP-16_L4.9-W3.9-P0.64-LS6.0-BL]  22.85 26.37 270 top
U19  -  [SMA]  -0.91 16.57 0 top
U20  -  [SMA]  54.09 71.58 0 top
U21  -  [SMA]  45.89 28.36 180 top
U22  -  [SMA]  100.98 83.28 180 top
U24  NE5532DR  [SOIC-8_L4.9-W3.9-P1.27-LS6.0-BL]  75.2 38.04 270 top
U25  NE5532DR  [SOIC-8_L4.9-W3.9-P1.27-LS6.0-BL]  77.33 76.59 270 top

## Footprints (pads in the part's own frame, mm; a bottom-side part is the same pattern mirrored in y, then rotated)
1*3跳线
  round 1.524 hole 0.914: 1(0,5.08) 2(0,2.54) 3(0,0)
C1210
  rect 1.635x2.7 smd: 1(-1.518,0) 2(1.518,0)
CONN-TH_XH2.54-6P
  round 1.65 hole 1.1: 1(-6.25,0) 2(-3.75,0) 3(-1.25,0) 4(1.25,0) 5(3.75,0) 6(6.25,0)
HDR-TH_2P-P2.54-V-F
  rect 1.7x1.7 hole 1: 1(-1.27,0)
  round 1.7 hole 1: 2(1.27,0)
LED_0805
  rect 1x1.25 smd: 1(-1.15,0.005) 2(1.05,0.005)
M3螺丝
  round 3.2 hole 3.2: 1(0,0)
MSOP-8_L3.0-W3.0-P0.65-LS4.9-BL
  rect 0.406x1.397 smd: 1(-0.975,-2.3) 2(-0.325,-2.3) 3(0.325,-2.3) 4(0.975,-2.3) 5(0.975,2.3) 6(0.325,2.3) 7(-0.325,2.3) 8(-0.975,2.3)
R0805
  rect 1.133x1.377 smd: 1(-1.111,0) 2(0.889,0)
R0805#2
  rect 1.133x1.377 smd: 1(-1,0) 2(1,0)
R_3296
  round 1.524 hole 0.762: 1(-2.499,-0.127) 2(0,-0.127) 3(2.499,-0.127)
SMA
  rect 4.8x1.2 smd: 1(3.81,8.412) 2(3.81,3.312) 5(3.81,5.862)
  rect 4.8x1.2 smd far side: 3(3.81,3.312) 4(3.81,8.412)
SOD-323_L1.7-W1.3-LS2.5-FD
  rect 0.78x0.5 smd: 1(-1.04,0) 2(1.04,0)
SOD-323_L1.8-W1.3-LS2.5-RD
  rect 1x0.75 smd: 1(-1.173,0) 2(1.173,0)
SOIC-8_L4.9-W3.9-P1.27-LS6.0-BL
  oval 0.588x2.045 smd: 1(-1.905,-2.772) 2(-0.635,-2.772) 3(0.635,-2.772) 4(1.905,-2.772) 5(1.905,2.772) 6(0.635,2.772) 7(-0.635,2.772) 8(-1.905,2.772)
SOIC-8_L5.0-W4.0-P1.27-LS6.1-BL
  oval 0.569x1.95 smd: 1(-1.905,-2.705) 2(-0.635,-2.705) 3(0.635,-2.705) 4(1.905,-2.705) 5(1.905,2.705) 6(0.635,2.705) 7(-0.635,2.705) 8(-1.905,2.705)
SOIC-14_L8.7-W3.9-P1.27-LS6.0-BL
  oval 0.574x2.038 smd: 1(-3.81,-2.769) 2(-2.54,-2.769) 3(-1.27,-2.769) 4(0,-2.769) 5(1.27,-2.769) 6(2.54,-2.769) 7(3.81,-2.769) 8(3.81,2.769) 9(2.54,2.769) 10(1.27,2.769) 11(0,2.769) 12(-1.27,2.769) 13(-2.54,2.769) 14(-3.81,2.769)
SSOP-16_L4.9-W3.9-P0.64-LS6.0-BL
  oval 0.355x1.815 smd: 1(-2.223,-2.655) 2(-1.587,-2.655) 3(-0.953,-2.655) 4(-0.318,-2.655) 5(0.318,-2.655) 6(0.953,-2.655) 7(1.587,-2.655) 8(2.223,-2.655) 9(2.223,2.655) 10(1.587,2.655) 11(0.953,2.655) 12(0.318,2.655) 13(-0.318,2.655) 14(-0.953,2.655) 15(-1.587,2.655) 16(-2.223,2.655)

## Nets
As in the schematic.

Pads without a net: PR14 3; SCREW1 1; SCREW2 1; SCREW3 1; SCREW4 1; SCREW5 1; SCREW6 1; SCREW7 1; SCREW8 1; SCREW9 1; SCREW10 1; SCREW11 1; SCREW12 1; SCREW13 1; SCREW14 1; SCREW15 1; SCREW16 1; U1 13; U3 1 5 8; U5 1 5 8; U18 5 12

## Via types
v1: diameter 0.61, hole 0.305, Top Layer to Bottom Layer, 296 vias

## Routing (per net, layer and track width the routed paths; a pad name or vN(x,y) marks a point on that pad's centre or on a via; arc(x,y) is an arc through that point)
+5V: length 317.7
  Top Layer w0.305: U18.16 25.5,28.58 24.48,28.58 24.13,28.94 C66.1 ; C67.2 21.8,30.96 21.8,28.92 21.47,28.59 20.19,28.59
  Top Layer w0.381: C16.1 20.68,64.35 20.68,67.05 20.34,67.39 U3.7 ; U25.8 83.15,78.5 C36.1 ; C7.1 C8.1 11.71,89.05 12.05,89.39 12.05,90.57 12.05,90.57 ; C10.2 C9.2 11.81,86.55 12.05,86.31 12.05,85.03 12.05,85.03 ; C22.2 37.09,89.15 37.51,88.73 38.79,88.73 U5.7 ; C23.2 33.43,72.67 C6.2 33.36,73.77 U7.1 U7.2 ; U24.8 77.96,39.92 76.53,39.92 76.2,40.26 C79.1 ; C41.1 76.04,22.04 76.45,21.64 U13.8
  Top Layer w0.508: C36.1 84.2,80.81 v1(84.23,80.85) ; C22.2 37.09,93.49 v1(36.52,94.05) ; v1(33.43,9.36) 33.44,9.38 R26.1 35.39,9.3 C59.2 C60.2 35.13,4.45 D8.1 ; C67.2 21.63,31.13 v1(22.98,31.13) 24.12,31.13 C66.1 ; v1(33.42,68.74) 33.43,68.75 C23.2 ; v1(93.77,84.24) 93.77,86.51 arc(93.78,86.54) R37.1
  Top Layer w0.762: v1(77.64,42.07) 76.3,42.07 C79.1 ; D4.1 38.12,54.64 C31.2 38.15,59.29 R18.1 38.03,59.4 v1(36.52,59.4) ; v1(78.34,23.78) 78.33,23.79 C41.1 ; R7.2 38.2,62.76 v1(36.54,62.76) ; C8.1 v1(8.77,87.85) C9.2 ; v1(85.98,10.11) 85.98,10.11 R80.1 87.94,10.06 C88.2 C89.2 87.89,4.79 D20.1 ; C16.1 18.99,63.95 v1(18.92,63.88) ; v1(88.82,64.39) 88.87,64.34 R35.1 90.66,64.24 C44.2 90.61,59.7 D16.1
  Bottom Layer w0.508: 36.52,68.75 36.51,68.74 v1(33.42,68.74) ; v1(22.98,31.13) 24.72,31.13 25.37,30.48 25.37,9.92 25.93,9.36 v1(33.43,9.36) ; v1(84.23,80.85) 88.79,80.85 arc(88.81,80.86) 88.82,80.88
  Bottom Layer w0.762: v1(85.98,10.11) 82.08,10.11 81.75,10.44 81.75,41.29 80.97,42.07 v1(77.64,42.07) ; v1(93.77,84.24) 89.85,84.24 arc(89.12,83.94) 88.82,83.22 v1(88.82,64.39) ; v1(78.34,23.78) 81.46,23.78 81.49,23.75 ; v1(18.92,63.88) 9.62,63.88 8.73,64.78 8.73,94.54 10,95.8 35.79,95.8 36.52,95.07 v1(36.52,94.05) v1(36.52,59.4)
-5V: length 239.5
  Top Layer w0.305: 20.19,24.15 21.32,24.15 21.59,23.88 C63.2 ; U18.9 24.36,24.15 24.09,23.88 C62.1
  Top Layer w0.381: U13.4 72.3,17.84 73.53,17.84 74.04,17.33 C85.1 ; C12.1 C11.1 20.01,86.49 19.67,86.15 19.67,85.03 ; U5.4 33.44,86.25 34.74,86.25 35.19,85.8 C20.1 ; C15.1 74.02,35.68 73.57,36.13 U24.4 ; 19.67,90.57 19.67,89.25 19.93,88.99 C13.2 C14.2 ; U3.4 24.28,69.9 22.64,69.9 22.28,70.26 C18.2
  Top Layer w0.457: U25.4 73.57,74.69 72.86,73.97 C37.1
  Top Layer w0.508: v1(11.28,9.54) 11.24,9.5 D6.1 9.58,9.5 9.58,4.76 12.37,4.76 D9.2 ; C62.1 24.01,21.57 v1(22.85,21.57) 21.67,21.57 C63.2 ; v1(22.31,73.51) 22.28,73.48 C18.2
  Top Layer w0.762: v1(71.31,33.53) C15.1 ; D5.2 14.84,54.66 C32.2 11.88,59.3 D3.1 13.62,59.31 v1(13.64,59.29) ; v1(65.94,70.13) 66.02,70.05 C37.1 ; D17.2 64.17,59.77 C45.2 64.15,64.58 D14.1 64.18,64.6 v1(65.97,64.6) ; C13.2 v1(22.92,87.73) C11.1 ; C85.1 73.96,15.56 v1(71.3,15.56) ; D21.2 64.54,5.19 C90.2 62.1,10.1 D18.1 63.75,10.18 v1(63.77,10.2) ; v1(33.72,83.94) 35.13,83.94 C20.1 ; 80.66,86.44 80.58,86.36 v1(78.72,86.36)
  Bottom Layer w0.508: v1(22.85,21.57) 22.85,10.21 22.18,9.54 v1(11.28,9.54)
  Bottom Layer w0.762: 22.3,83.94 22.3,87.1 v1(22.92,87.73) ; 22.3,83.94 22.3,60.71 20.87,59.29 v1(13.64,59.29) ; 22.3,83.94 v1(33.72,83.94) ; v1(65.97,64.6) 65.97,85.39 66.94,86.36 v1(78.72,86.36) ; v1(63.77,10.2) 70.69,10.2 71.31,10.81 v1(71.31,33.53)
GND:
  vias: v1(1.51,36.76) v1(1.51,35.68) v1(1.51,34.6) v1(2.13,91.72) v1(2.13,90.64) v1(2.13,89.56) v1(2.15,87.42) v1(2.15,86.34) v1(2.15,85.26) v1(2.09,28.44) v1(2.09,27.31) v1(2.64,36.76) v1(2.64,35.68) v1(2.64,34.6) v1(3.17,28.44) v1(3.17,27.31) v1(3.26,91.72) v1(3.26,90.64) v1(3.26,89.56) v1(3.28,87.42) v1(3.28,86.34) v1(3.28,85.26) v1(3.69,14.51) v1(3.69,13.43) v1(3.69,12.35) v1(4.25,28.44) v1(4.25,27.31) v1(4.36,36.69) v1(4.36,35.61) v1(4.36,34.53) v1(4.82,14.51) v1(4.82,13.43) v1(4.82,12.35) v1(5.49,36.69) v1(5.49,35.61) v1(5.49,34.53) v1(6.1,14.46) v1(6.1,13.38) v1(6.1,12.3) v1(7.24,14.46) v1(7.24,13.38) v1(7.24,12.3) v1(8.44,14.46) v1(8.44,13.38) v1(8.44,12.3) v1(9.58,14.46) v1(9.58,13.38) v1(9.58,12.3) v1(13.96,88.44) v1(13.96,86.89) v1(15.18,22.48) v1(15.67,86.89) v1(15.95,88.44) v1(15.95,75.94) v1(15.95,74.86) v1(15.95,73.78) v1(17.08,75.94) v1(17.08,74.86) v1(17.08,73.78) v1(17.59,88.55) v1(17.59,86.72) v1(18.47,75.94) v1(18.47,74.86) v1(18.47,73.78) v1(19.6,75.94) v1(19.6,74.86) v1(19.6,73.78) v1(36.99,14.33) v1(36.99,13.25) v1(36.99,12.17) v1(38.12,14.33) v1(38.12,13.25) v1(38.12,12.17) v1(38.21,36.47) v1(38.21,35.39) v1(38.21,34.32) v1(39.35,36.47) v1(39.35,35.39) v1(39.35,34.32) v1(39.3,14.33) v1(39.3,13.25) v1(39.3,12.17) v1(40.43,14.33) v1(40.43,13.25) v1(40.43,12.17) v1(41.28,36.47) v1(41.28,35.39) v1(41.28,34.32) v1(41.36,69.88) v1(41.36,68.75) v1(41.66,97.74) v1(41.66,96.66) v1(41.66,95.58) v1(42.44,69.88) v1(42.44,68.75) v1(42.42,36.47) v1(42.42,35.39) v1(42.42,34.32) v1(42.79,97.74) v1(42.79,96.66) v1(42.79,95.58) v1(43.52,69.88) v1(43.52,68.75) v1(45.35,69.88) v1(45.35,68.75) v1(46.43,69.88) v1(46.43,68.75) v1(47.51,69.88) v1(47.51,68.75) v1(52.14,16.14) v1(52.14,15.06) v1(52.14,13.98) v1(52.9,41.06) v1(52.9,39.98) v1(52.9,38.9) v1(52.94,36.97) v1(52.94,35.9) v1(52.94,34.82) v1(53.27,16.14) v1(53.27,15.06) v1(53.27,13.98) v1(54.03,41.06) v1(54.03,39.98) v1(54.03,38.9) v1(54.07,36.97) v1(54.07,35.9) v1(54.07,34.82) v1(54.67,16.14) v1(54.67,15.06) v1(54.67,13.98) v1(55.6,41.06) v1(55.6,39.98) v1(55.6,38.9) v1(55.62,36.97) v1(55.62,35.9) v1(55.62,34.82) v1(55.8,16.14) v1(55.8,15.06) v1(55.8,13.98) v1(56.34,71.8) v1(56.34,70.72) v1(56.34,69.64) v1(56.62,91.34) v1(56.62,90.26) v1(56.62,89.18) v1(56.64,87.28) v1(56.64,86.2) v1(56.64,85.12) v1(56.74,41.06) v1(56.74,39.98) v1(56.74,38.9) v1(56.75,36.97) v1(56.75,35.9) v1(56.75,34.82) v1(57.31,16.13) v1(57.31,15.05) v1(57.31,13.97) v1(57.47,71.8) v1(57.47,70.72) v1(57.47,69.64) v1(57.75,91.34) v1(57.75,90.26) v1(57.75,89.18) v1(57.77,87.28) v1(57.77,86.2) v1(57.77,85.12) v1(58.45,16.13) v1(58.45,15.05) v1(58.45,13.97) v1(58.92,71.85) v1(58.92,70.77) v1(58.92,69.69) v1(59.27,91.37) v1(59.27,90.29) v1(59.27,89.21) v1(59.29,87.25) v1(59.29,86.17) v1(59.29,85.1) v1(60.06,71.85) v1(60.06,70.77) v1(60.06,69.69) v1(60.4,91.37) v1(60.4,90.29) v1(60.4,89.21) v1(60.42,87.25) v1(60.42,86.17) v1(60.42,85.1) v1(73.12,22.58) v1(73.99,21.97) v1(84.58,44.8) v1(84.58,43.72) v1(84.58,42.64) v1(85.71,44.8) v1(85.71,43.72) v1(85.71,42.64) v1(86.85,44.77) v1(86.85,43.69) v1(86.85,42.61) v1(87.98,44.77) v1(87.98,43.69) v1(87.98,42.61) v1(93.62,71.4) v1(93.62,70.32) v1(93.62,69.25) v1(94.25,35.02) v1(94.25,33.94) v1(94.25,32.86) v1(94.55,15.91) v1(94.55,14.83) v1(94.55,13.75) v1(94.75,71.4) v1(94.75,70.32) v1(94.75,69.25) v1(95.38,35.02) v1(95.38,33.94) v1(95.38,32.86) v1(95.68,15.91) v1(95.68,14.83) v1(95.68,13.75) v1(96.28,71.42) v1(96.28,70.34) v1(96.28,69.26) v1(96.28,35.02) v1(96.28,33.94) v1(96.28,32.86) v1(96.78,90.14) v1(96.78,89.06) v1(96.78,87.98) v1(97.23,15.93) v1(97.23,14.85) v1(97.23,13.77) v1(97.41,71.42) v1(97.41,70.34) v1(97.41,69.26) v1(97.42,35.02) v1(97.42,33.94) v1(97.42,32.86) v1(97.91,90.14) v1(97.91,89.06) v1(97.91,87.98) v1(98.36,15.93) v1(98.36,14.85) v1(98.36,13.77)
CH_1: length 8.6
  Top Layer w0.381: R43.1 12.2,33.25 8.01,33.25 7.68,32.91 C71.2 7.64,31.8 R39.2
CH_2: length 28.2
  Top Layer w0.381: v1(15.28,30.72) 14.24,30.72 R42.2 14.2,28.85 R45.1 10.4,26.85 9.86,26.31 9.86,20.88 10.25,20.48 12.2,20.48 R47.1 ; 20.19,27.32 22.08,27.32 v1(22.09,27.33)
  Bottom Layer w0.381: v1(22.09,27.33) 22.09,30.33 21.7,30.72 v1(15.28,30.72)
CH_3: length 23.7
  Top Layer w0.381: R46.2 17.93,17.99 ; 17.93,17.99 18.03,18.08 18.03,26.2 18.52,26.69 20.19,26.69 ; 17.93,17.99 23.75,17.99 24.38,17.36 24.38,14.76 C74.2
CH_4: length 8.9
  Top Layer w0.381: 20.19,27.96 17.65,27.96 17.12,27.42 17.12,25.08 16.38,24.35 R44.2
CH_5: length 20.1
  Top Layer w0.381: R49.1 30.16,23.23 30.55,22.85 33.08,22.85 34.2,21.72 34.2,15.57 33.37,14.75 C74.1
CH_6: length 19.6
  Top Layer w0.381: R50.2 32.16,28.87 R48.2 29.71,27.32 28.35,27.32 ; 28.35,27.32 28.35,22.41 28.83,21.93 31.64,21.93 32.16,21.4 R52.2 ; 28.35,27.32 U18.14
CH_7: length 9.4
  Top Layer w0.381: U18.15 27.85,27.96 28.3,28.41 28.3,32.7 28.89,33.29 R51.1
CH_8: length 33.9
  Top Layer w0.381: v1(30.14,16.19) 30.16,16.21 R53.1 27.64,18.02 27.32,18.33 27.32,26.24 26.88,26.69 U18.13 ; v1(35.07,28.69) 35.09,28.71 R41.2
  Bottom Layer w0.381: v1(35.07,28.69) 35.07,16.55 34.71,16.19 v1(30.14,16.19)
VG: length 27.2
  Top Layer w0.381: 13.32,85.03 13.32,71.25 12.41,70.35 10.95,70.35 10.35,69.75 D1.2 10.35,66.02 C2.2 R9.2 C3.2
VO1: length 22.5
  Top Layer w0.381: R23.1 43.41,82.35 42.97,81.92 30.65,81.92 30.31,81.58 30.31,78.7 ; R14.2 R12.2
VO2: length 21.5
  Top Layer w0.381: v1(23.59,73.52) 23.59,74.99 R15.2 R16.1 ; R21.2 31.76,66.73 v1(31.78,66.75)
  Bottom Layer w0.381: v1(31.78,66.75) 31.78,72.83 31.08,73.52 v1(23.59,73.52)
VOUT1: length 29.3
  Top Layer w0.381: R10.1 27.02,85.65 26.63,86.04 26.63,97.27 25.99,97.91 14.93,97.91 14.6,97.58 R20.1 R5.1
$1N491: length 15.4
  Top Layer w0.381: v1(10.62,81.39) 11.91,81.39 C30.2 ; v1(14.43,83.25) 14.59,83.41 14.59,85.03 ; R1.2 10.57,74.96 v1(10.57,76.02)
  Bottom Layer w0.381: v1(14.43,83.25) 10.94,83.25 10.57,82.88 v1(10.57,76.02)
$1N504: length 4
  Top Layer w0.381: R3.2 18.4,82.73 18.4,85.03
$1N512: length 4
  Top Layer w0.381: 15.86,85.03 15.86,82.84 R2.2
$1N517: length 3.5
  Top Layer w0.381: 17.13,85.03 17.07,84.98 R19.2
$1N643: length 5.6
  Top Layer w0.381: 17.13,90.57 17.13,92.26 16.46,92.93 15.18,92.93 14.6,93.51 R20.2
$1N648: length 5.5
  Top Layer w0.381: R5.2 12.1,93.47 12.79,92.78 13.9,92.78 14.59,92.09 14.59,90.57
$1N687: length 6.8
  Top Layer w0.381: R4.2 C1.2 19.6,93.69 18.38,92.47 18.38,90.59 18.4,90.57
$1N1069: length 2.9
  Top Layer w0.381: R6.1 26.39,68.66 U3.3
$1N1078: length 45.7
  Top Layer w0.381: U4.1 3.25,60.77 43.24,60.77 44.85,62.39 44.85,64.42 PR1.2
$1N1137: length 4.2
  Top Layer w0.381: 42.32,64.46 41.91,64.86 R7.1
$1N1275: length 3
  Top Layer w0.381: U3.6 16.67,68.66 R8.2
$1N1439: length 3.7
  Top Layer w0.381: D1.1 15.93,67.4 R8.1
$1N1895: length 2.5
  Top Layer w0.381: C4.2 R13.1
$1N1903: length 3.8
  Top Layer w0.381: U5.3 32.29,87.51 R10.2
$1N1952: length 5.8
  Top Layer w0.381: U5.2 31.06,88.78 R22.1 R11.2
$1N2033: length 39.1
  Top Layer w0.381: U6.5 47.19,74.92 H2.1 42.69,74.96 C33.1 39.47,79.64 39.88,80.05 46.35,80.05 47.25,80.94 47.25,91.37 46.26,92.36 41.59,92.36 41.25,92.01 41.25,90.85 R13.2
$1N2249: length 3.6
  Top Layer w0.381: U7.3 35.84,75.76 C5.2
$1N2305: length 6.9
  Top Layer w0.381: C5.1 36.27,78.18 36.27,80.32 35.95,80.64 R14.1
$1N2544: length 2.5
  Top Layer w0.381: U7.7 25.69,75.11 R15.1
$1N2549: length 22.3
  Top Layer w0.381: C6.1 35.37,72.74 36.86,72.74 37.24,72.36 37.24,69.11 35.96,67.82 31.54,67.82 31.06,68.3 31.06,75.11 30.41,75.76 U7.6
$1N3910: length 2.1
  Top Layer w0.762: R17.2 9.67,59.3 D3.2
$1N3915: length 2.2
  Top Layer w0.762: D2.2 42.27,59.3 R18.2
$1N4189: length 13.4
  Top Layer w0.381: U2.5 7.28,74.9 H1.1 7.29,78.91 7.92,79.55 12.07,79.55 C30.1
$1N4691: length 2.5
  Top Layer w0.381: R2.1 R19.1
$1N4821: length 2.9
  Top Layer w0.381: U3.2 26.3,67.39 R21.1
$1N4890: length 8
  Top Layer w0.305: 29.09,80.64 29.41,80.96 29.41,87.18 R22.2
$1N4959: length 5.3
  Top Layer w0.381: R23.2 C4.1 40.72,87.51 U5.6
$1N9203: length 7
  Top Layer w0.508: CN24.2 CN24.1
  Top Layer w0.762: CN24.1 17.61,52.33 D5.1
$1N9205: length 7.1
  Top Layer w0.762: 31.14,53.71 31.21,53.64 31.21,53.54 CN24.5 ; CN24.6 32.56,52.29 D4.2
$1N10453: length 39.5
  Top Layer w0.381: R6.2 28.96,71.17 v1(28.94,71.19) ; v1(29,62.62) 28.12,61.75 5.69,61.75 5.11,62.33 5.11,63.65 4.47,64.29 U4.2
  Bottom Layer w0.381: v1(28.94,71.19) 29,71.13 v1(29,62.62)
$2N1531: length 13.7
  Top Layer w0.381: U21.5 42.03,22.45 H9.1 37.14,26.63 R41.1 ; 37.06,26.71 39.36,26.71 40.08,27.43 C73.2
$2N1538: length 19.4
  Top Layer w0.381: U18.11 19.09,25.42 18.77,25.09 18.77,19.95 v1(19.22,19.49) ; v1(21.41,16.17) 21.41,14.76 C70.2
  Bottom Layer w0.381: v1(21.41,16.17) 21.41,19.15 21.07,19.49 v1(19.22,19.49)
$2N1565: length 9.3
  Top Layer w0.381: R39.1 7.66,26.97 H7.1 7.64,22.44 2.9,22.44
$2N1568: length 6.9
  Top Layer w0.508: CN25.1 14.94,2.44 D9.1
  Top Layer w0.762: CN25.2 CN25.1
$2N1570: length 2
  Top Layer w0.508: D6.2 5.36,9.5 R25.2
$2N1573: length 7
  Top Layer w0.508: D8.2 30.38,2.1 28.74,3.75
  Top Layer w0.762: CN25.5 28.74,3.75
$2N1579: length 2.4
  Top Layer w0.508: R26.2 39.5,9.38 D7.2
$2N1653: length 3.3
  Top Layer w0.381: R43.2 12.2,31.25 R42.1
$2N1703: length 3.3
  Top Layer w0.381: R45.2 14.2,26.35 R44.1
$2N1753: length 3.3
  Top Layer w0.381: R47.2 14.2,19.99 R46.1
$2N1803: length 2.5
  Top Layer w0.381: R49.2 R48.1
$2N1853: length 3.3
  Top Layer w0.381: R50.1 30.16,31.29 R51.2
$2N1903: length 3.3
  Top Layer w0.381: R53.2 32.16,18.52 R52.1
$3N1231: length 2.1
  Top Layer w0.762: R34.2 D14.2
$3N1232: length 7
  Top Layer w0.762: D16.2 85.2,57.36 CN27.6 CN27.5
$3N1233: length 7.1
  Top Layer w0.762: D17.1 70.06,57.43 CN27.1 CN27.2
$3N1240: length 2.3
  Top Layer w0.381: R35.2 94.83,64.34 arc(94.86,64.33) D15.2
$3N1461: length 10.4
  Top Layer w0.381: U20.5 62.57,77.44 H11.1 63.53,76.54 R30.2
$3N1620: length 7.9
  Top Layer w0.381: U25.2 70.63,77.23 R30.1 R31.2
$3N1622: length 41.5
  Top Layer w0.381: R27.1 87.53,73.55 88.3,74.32 88.3,81.3 87.53,82.07 72.29,82.07 72.21,82.16 ; U25.1 72.63,78.5 72.21,78.92 72.21,82.16 ; 72.21,82.16 72.21,84.61 71.5,85.31 68.43,85.31 67.78,85.97 67.78,88.42 PR14.2
$3N1624: length 5.6
  Top Layer w0.381: U25.3 72.36,75.96 R29.2
$3N2038: length 12.9
  Top Layer w0.381: U25.6 83.61,75.96 R56.2 R27.2 84.22,73.53 84.22,70.58 83.69,70.05 R28.1
$3N2039: length 5.8
  Top Layer w0.381: U25.5 79.05,74.69 78.86,74.5 R54.2
$3N2040: length 44.2
  Top Layer w0.381: v1(77.78,76.95) 78.06,77.23 U25.7 ; U22.5 97.17,77.42 H10.1 91.86,77.44 90.6,77.44 90.06,76.9 90.06,71.5 arc(90.06,71.5) 90.06,71.5 90.06,68.98 arc(89.78,68.32) 89.13,68.05 R28.2 81.85,68.05 v1(81.85,65.45)
  Bottom Layer w0.381: v1(81.85,65.45) 78.51,65.45 77.78,66.18 v1(77.78,76.95)
$3N2047: length 29.1
  Top Layer w0.381: v1(75.86,84.72) 75.91,84.68 R55.2 ; v1(75.85,71.09) 75.85,70.05 R24.2 76.86,70.05 R54.1
  Bottom Layer w0.381: v1(75.85,71.09) 75.86,71.1 v1(75.86,84.72)
$3N2048: length 4.4
  Top Layer w0.381: 80.66,88.44 80.86,88.64 84.69,88.64 84.89,88.43
$3N2049: length 4.2
  Top Layer w0.381: PR15.2 88.39,87.43 R55.1
$3N2050: length 4
  Top Layer w0.381: PR15.3 93.69,88.43 arc(93.77,88.46) R37.2
$3N3220: length 13.6
  Top Layer w0.381: R31.1 65.87,79.54 65.29,80.13 PR14.1 65.29,90.86
$4N1791: length 7.3
  Top Layer w0.305: U8.5 57.42,25.04 H12.1 60.2,25 C80.1
$4N1794: length 14.1
  Top Layer w0.305: R57.1 67.61,33.98 62.81,33.98 62.25,33.42 C80.2
$4N1799: length 15.4
  Top Layer w0.305: 70.85,43.62 73.57,43.62 73.71,43.77 C75.2 ; 70.85,43.62 69.93,43.62 69.62,43.32 69.62,41.48 R58.2 ; 70.85,43.62 70.89,43.58 70.89,37.71 71.19,37.4 U24.3
$4N1802: length 18.4
  Top Layer w0.381: C78.1 83.73,30.74 84.23,31.24 84.23,37.35 83.9,37.69 80.44,37.69 ; R71.2 80.44,37.69 ; 80.44,37.69 R60.2
$4N1806: length 5.7
  Top Layer w0.381: U14.3 92.35,22.39 R68.2 89.41,22.36 C86.1
$4N1807: length 82.1
  Top Layer w0.381: C46.1 63.82,19.72 v1(63.84,19.73) ; C17.1 89.46,27.52 R61.2 92.39,27.51 U14.1
  Bottom Layer w0.381: U14.1 92.44,27.56 92.44,46.36 91.73,47.08 64.68,47.08 63.84,46.24 v1(63.84,19.73)
$4N1808: length 25
  Top Layer w0.381: U24.7 U24.6 77.95,37.38 v1(76.15,37.38) ; R61.1 87.44,28.2 87.08,28.56 77.17,28.56 76.62,29.11 C78.2
  Bottom Layer w0.381: v1(76.65,29.22) 76.15,29.72 v1(76.15,37.38)
$4N1809: length 13.7
  Top Layer w0.381: C77.2 74.59,30.64 75.12,31.17 75.12,31.81 75.51,32.19 79.9,32.19 80.47,32.77 80.47,33.88 R59.2 78.36,33.91 77.98,34.29 77.98,36.12 U24.5
$4N1810: length 18.2
  Top Layer w0.381: R65.2 69.91,15.59 70.34,16.02 70.34,18.68 70.75,19.1 ; v1(75.02,26.81) 75.04,26.79 C84.2 ; v1(74.62,19.11) 72.3,19.11 U13.3 70.75,19.1
  Bottom Layer w0.381: v1(74.62,19.11) 75.02,19.51 v1(75.02,26.81)
$4N1817: length 37.3
  Top Layer w0.381: v1(79.33,20.37) 79.32,20.37 U13.7 U13.6 ; 87.44,22.39 v1(87.44,20.82) 87.44,20.82 87.44,12.78 85.72,11.07 v1(76.52,11.07) 76.5,11.1 C40.2
  Bottom Layer w0.381: v1(76.52,11.07) 76.52,19.94 76.96,20.37 v1(79.33,20.37)
$4N1818: length 15.3
  Top Layer w0.381: C39.2 73.5,13.65 73.93,14.08 80.59,14.08 81.05,14.54 81.05,15.56 R66.2 78.23,15.57 77.83,15.97 77.83,17.83
$4N1821: length 4.8
  Top Layer w0.381: U11.5 97.18,24.97 U14.2
$4N1832: length 18.1
  Top Layer w0.381: R77.2 81.04,19.37 ; 81.04,19.37 R67.2 ; 81.04,19.37 81.09,19.31 84.01,19.31 84.81,18.52 84.81,13.89 83.45,12.53 C40.1
$4N1892: length 2.5
  Top Layer w0.381: R71.1 R59.1
$4N1938: length 3.3
  Top Layer w0.305: R72.1 67.62,35.97 R57.2
$4N2036: length 2.5
  Top Layer w0.305: R73.2 R58.1
$4N2042: length 30.2
  Top Layer w0.305: R72.2 69.62,37.74 ; 69.62,37.74 R73.1 ; 69.62,37.74 65.75,37.74 65.44,38.05 65.44,47.55 65.95,48.06 76.33,48.06 76.71,47.68 76.71,45.44
$4N2148: length 2.5
  Top Layer w0.381: R60.1 R74.1
$4N2160: length 18.2
  Top Layer w0.305: U24.1 U24.2
  Top Layer w0.381: C76.2 80.16,45.44 80.44,45.16 80.44,41.42 ; U24.1 74.34,39.94 v1(74.34,39.93)
  Bottom Layer w0.381: v1(80.41,43.55) 74.83,43.55 74.34,43.07 v1(74.34,39.93)
$4N2277: length 3.3
  Top Layer w0.381: R75.2 68.82,22.59 R64.1
$4N2329: length 2.5
  Top Layer w0.381: R65.1 R76.2
$4N2333: length 10.9
  Top Layer w0.381: R76.1 R64.2 69.94,20.59 70.46,21.11 70.46,26.37 70.88,26.79 C38.1
$4N2347: length 5.3
  Top Layer w0.381: C46.2 63.56,21.72 64.93,23.09 R75.1
$4N2430: length 2.5
  Top Layer w0.381: R66.1 R77.1
$4N2466: length 2.5
  Top Layer w0.381: R67.1 R78.1
$4N2477: length 17.3
  Top Layer w0.381: 72.8,25.7 73.2,25.3 80.46,25.3 81.04,24.72 R78.2 ; 72.8,25.7 72.29,25.19 U13.1 U13.2 ; 72.8,25.7 73.56,26.47 C38.2
$4N3036: length 6.8
  Top Layer w0.762: D20.2 82.53,2.44 CN28.6 ; CN28.5 81.1,3.7 81.19,3.62
$4N3037: length 6.9
  Top Layer w0.762: D21.1 67.56,2.5 CN28.1 CN28.2
$4N3040: length 2.4
  Top Layer w0.762: D19.2 92.23,10.11 R80.2
$4N3044: length 2.1
  Top Layer w0.762: D18.2 59.96,10.2 R79.2

## Copper pours and planes (outline as drawn; the poured copper is in the pictures)
GND on Top Layer: -17.71,111.71 121.04,111.71 121.04,-24.21 -17.71,-24.21
GND on Bottom Layer: -16.29,112.28 116.8,112.28 116.8,-26.47 -16.29,-26.47

Small or netless copper shapes (teardrops, artwork), in the pictures only: 476 on Top Layer, 38 on Bottom Layer

## Text on the board
Top Solder Mask Layer: LOW_Filter | LTC1568_Filter | AGC_VCA821 | 直流偏置放大器
Top Silkscreen Layer: INT | OUT | 增益调节 | 偏置调节
